# Altium schematic sheet PolXMain.SchDoc
size A0; SheetNumber: 0; SheetTotal: 0; PageSetup: Record=PageOptions|CenterHorizontal=True|CenterVertical=True|PrintScale=0.50|XCorrection=1.00|YCorrection=1.00|PrintKind=2|BorderSize=5000000|LeftOffset=0|BottomOffset=0|Orientation=2|PaperLength=1000|PaperWidth=1000|Scale=100|PaperSource=7|PrintQuality=-4|MediaType=1|DitherType=10|PaperKind=A4|PrintScaleMode=1
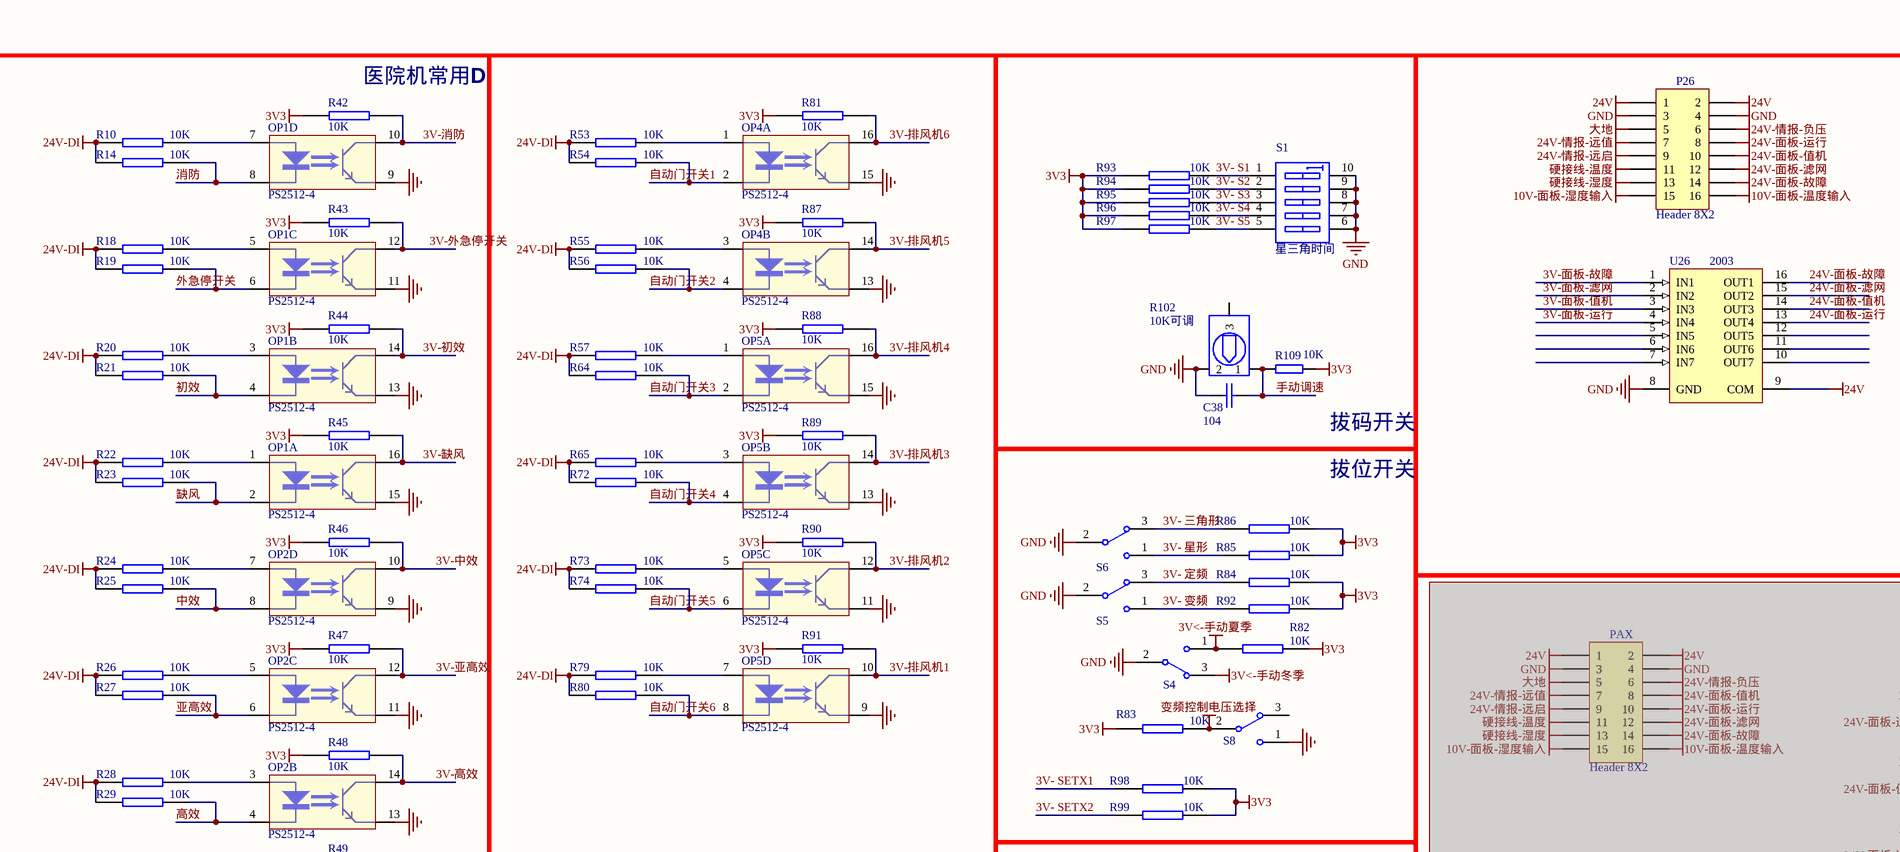
[diagram p0: PolXMain.SchDoc, top left]
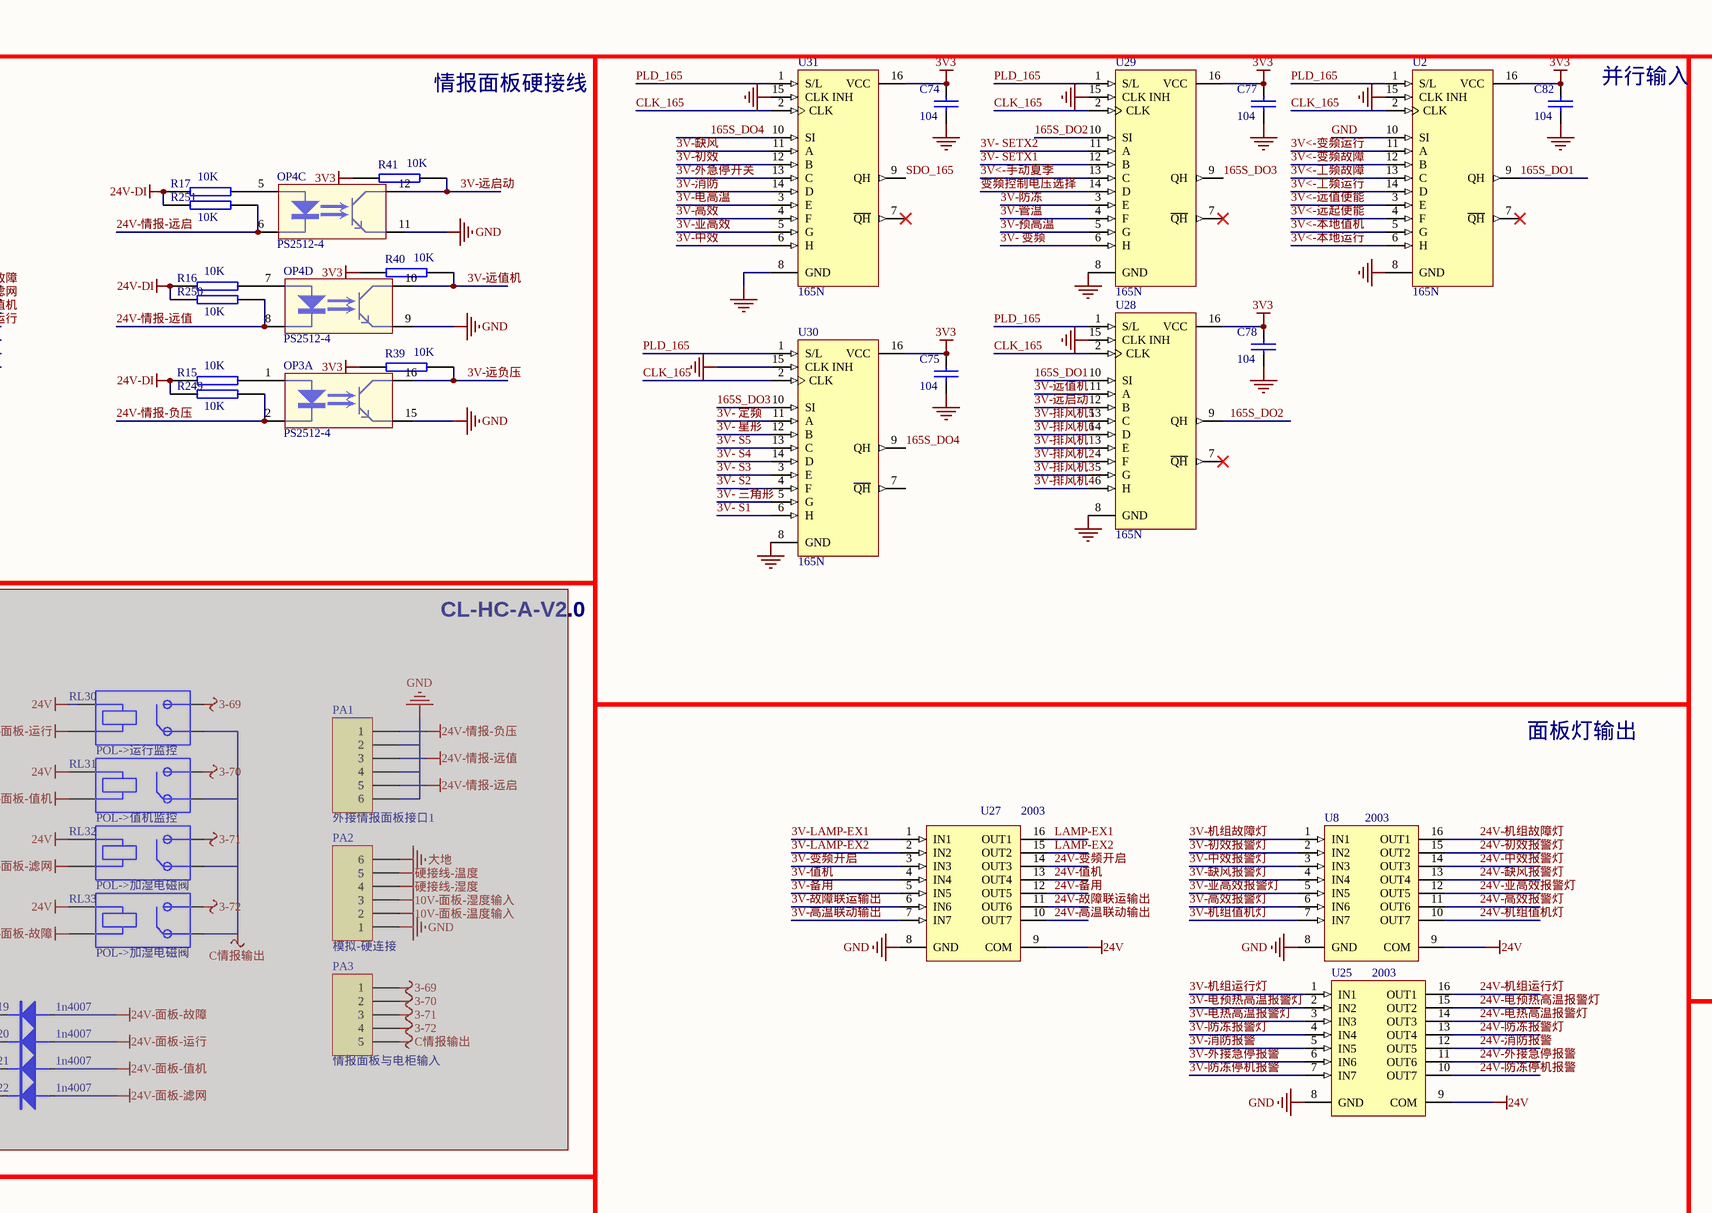
[diagram p1: PolXMain.SchDoc, top middle]
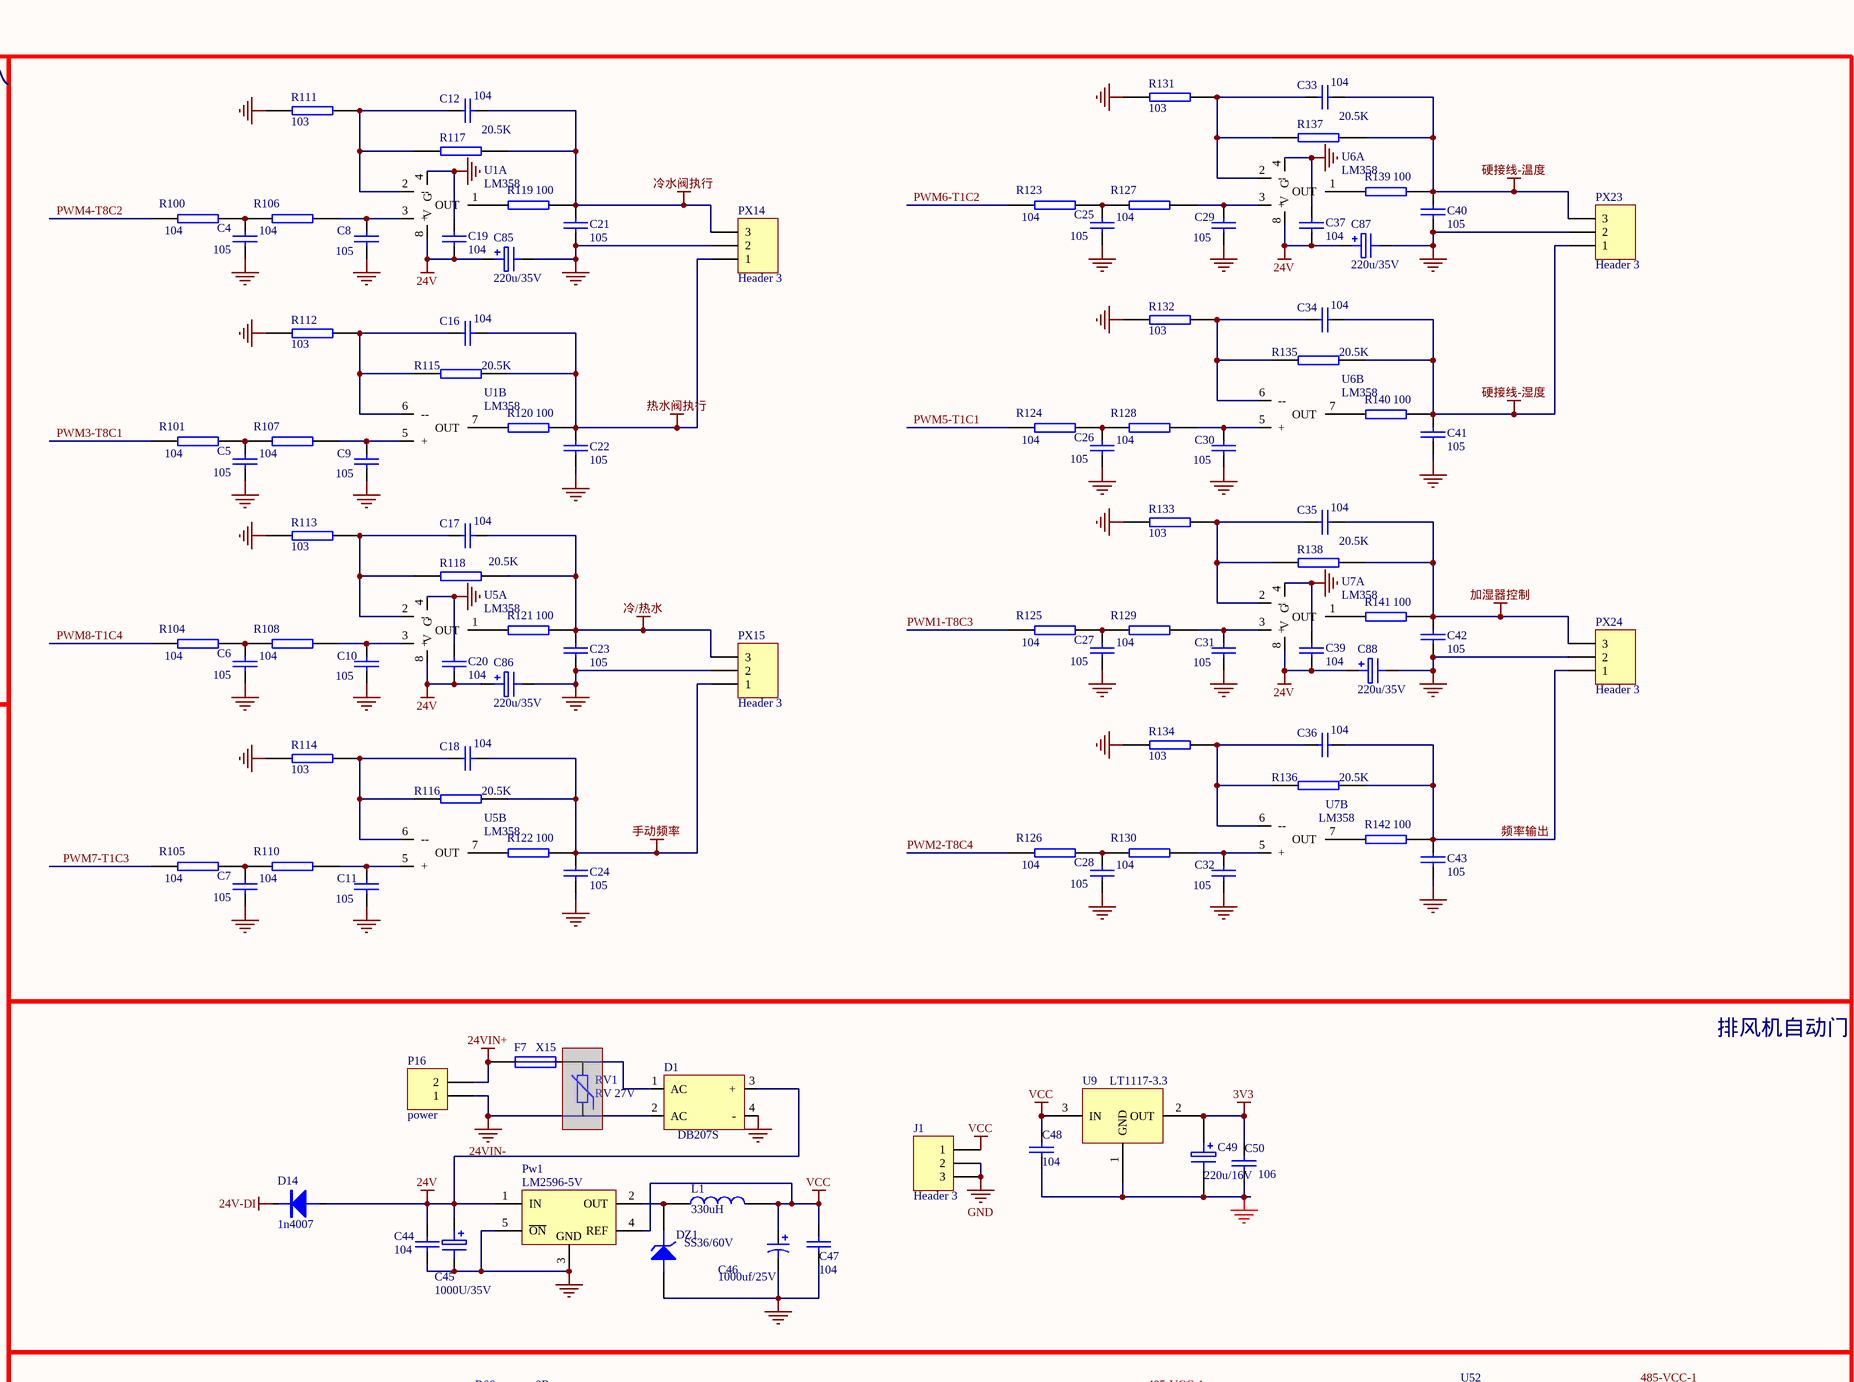
[diagram p2: PolXMain.SchDoc, top right]
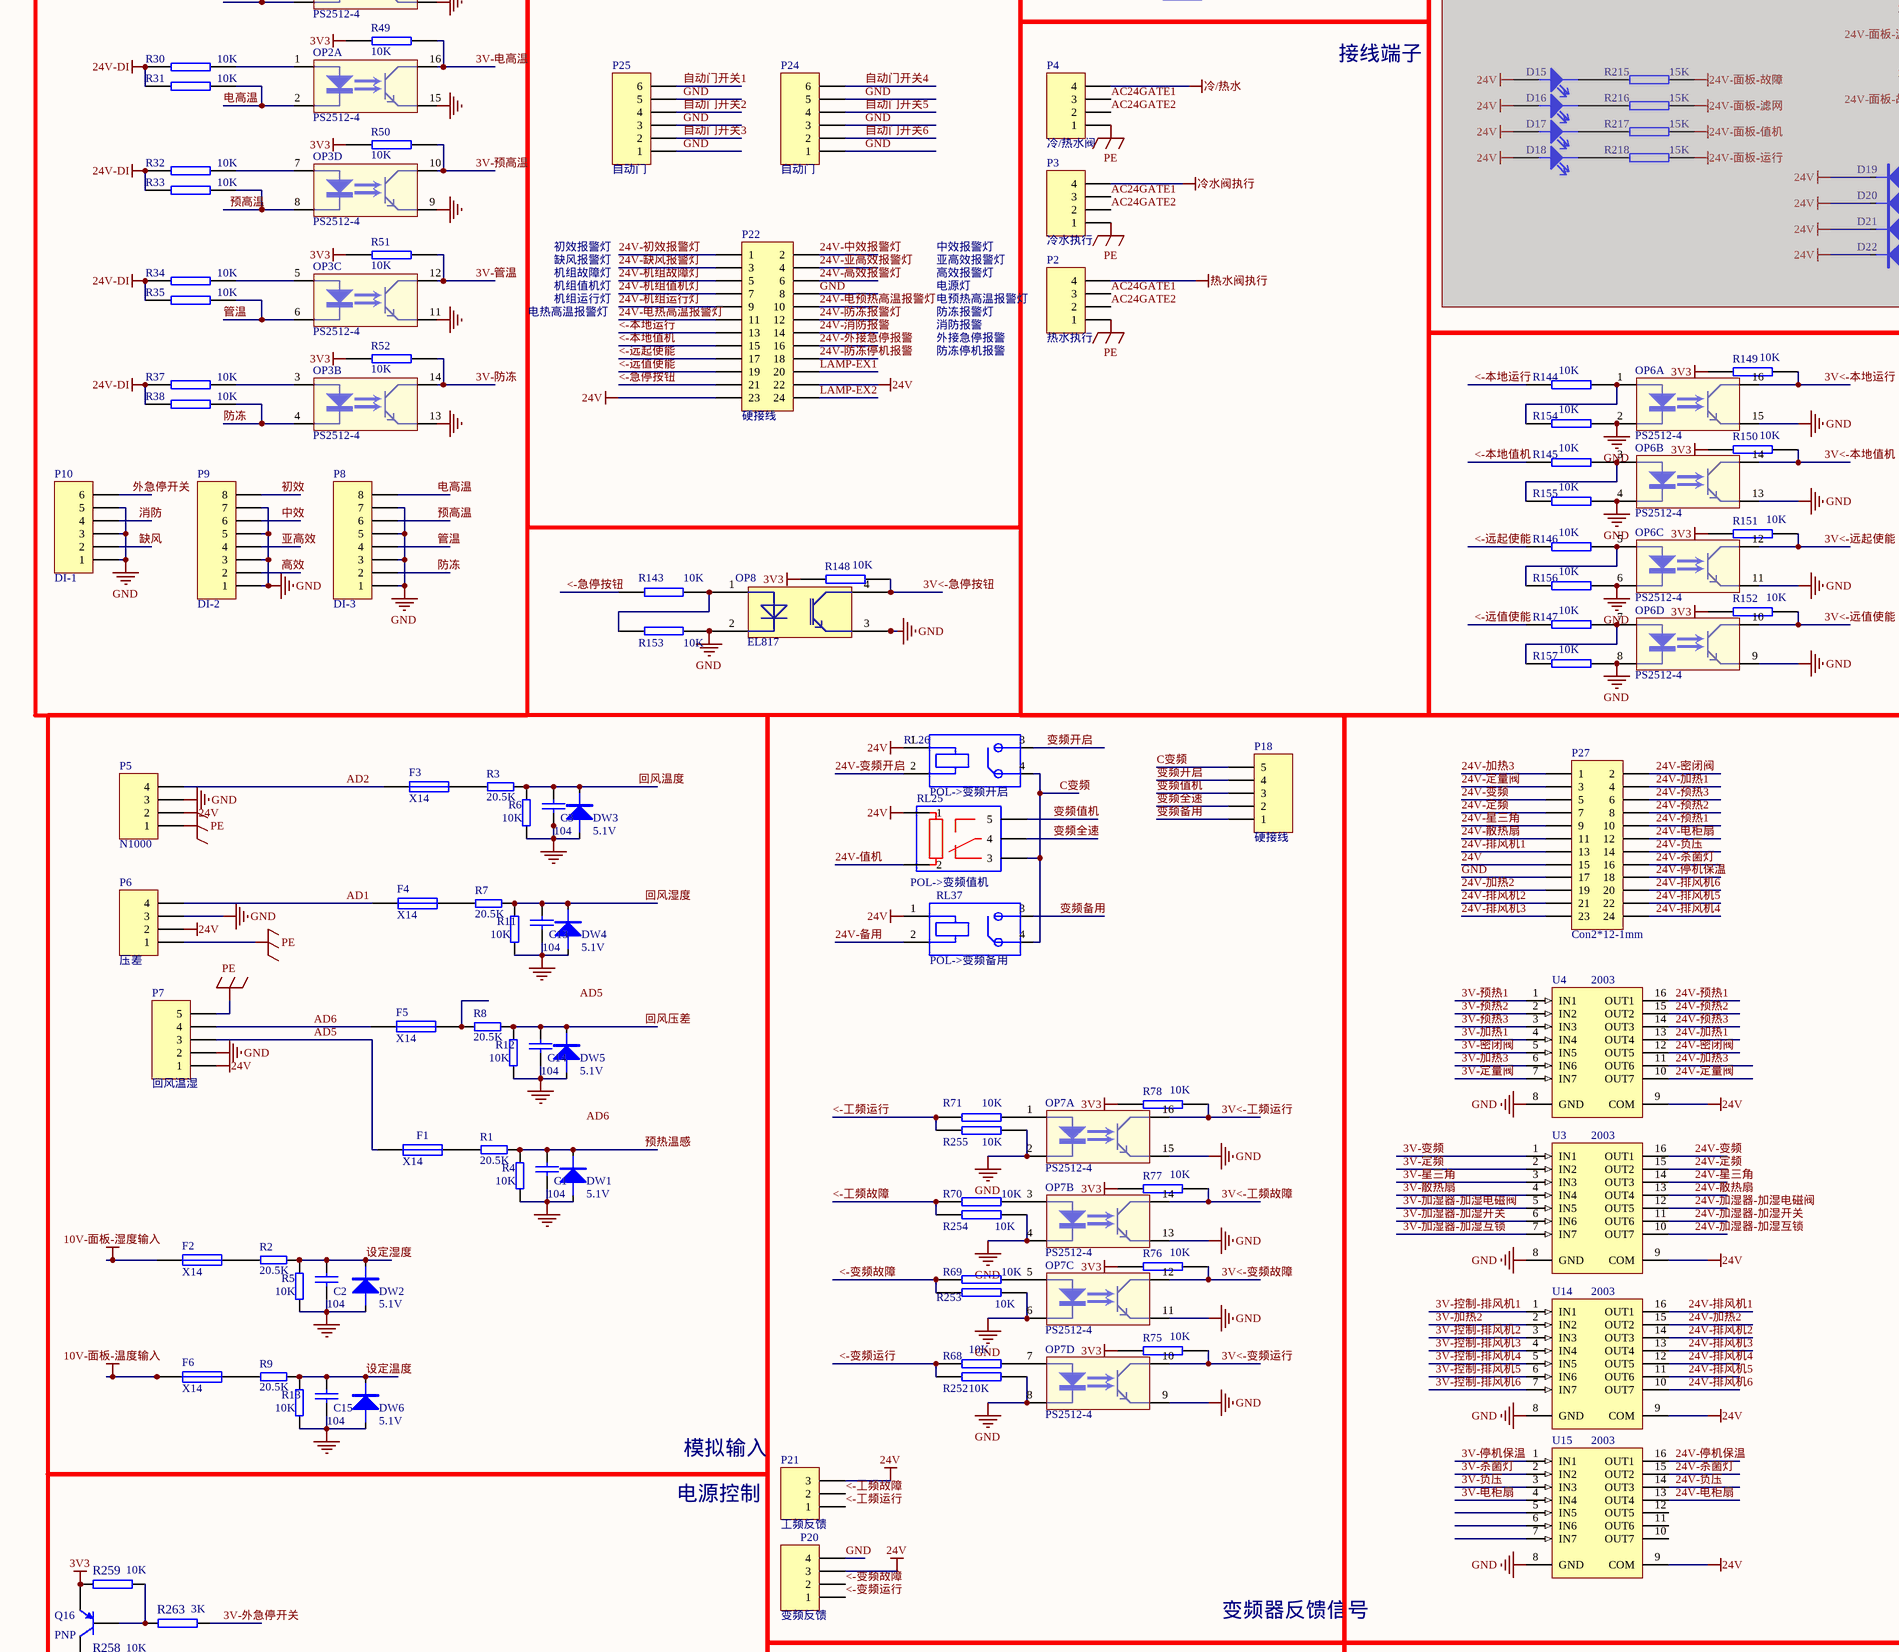
[diagram p3: PolXMain.SchDoc, centre left]
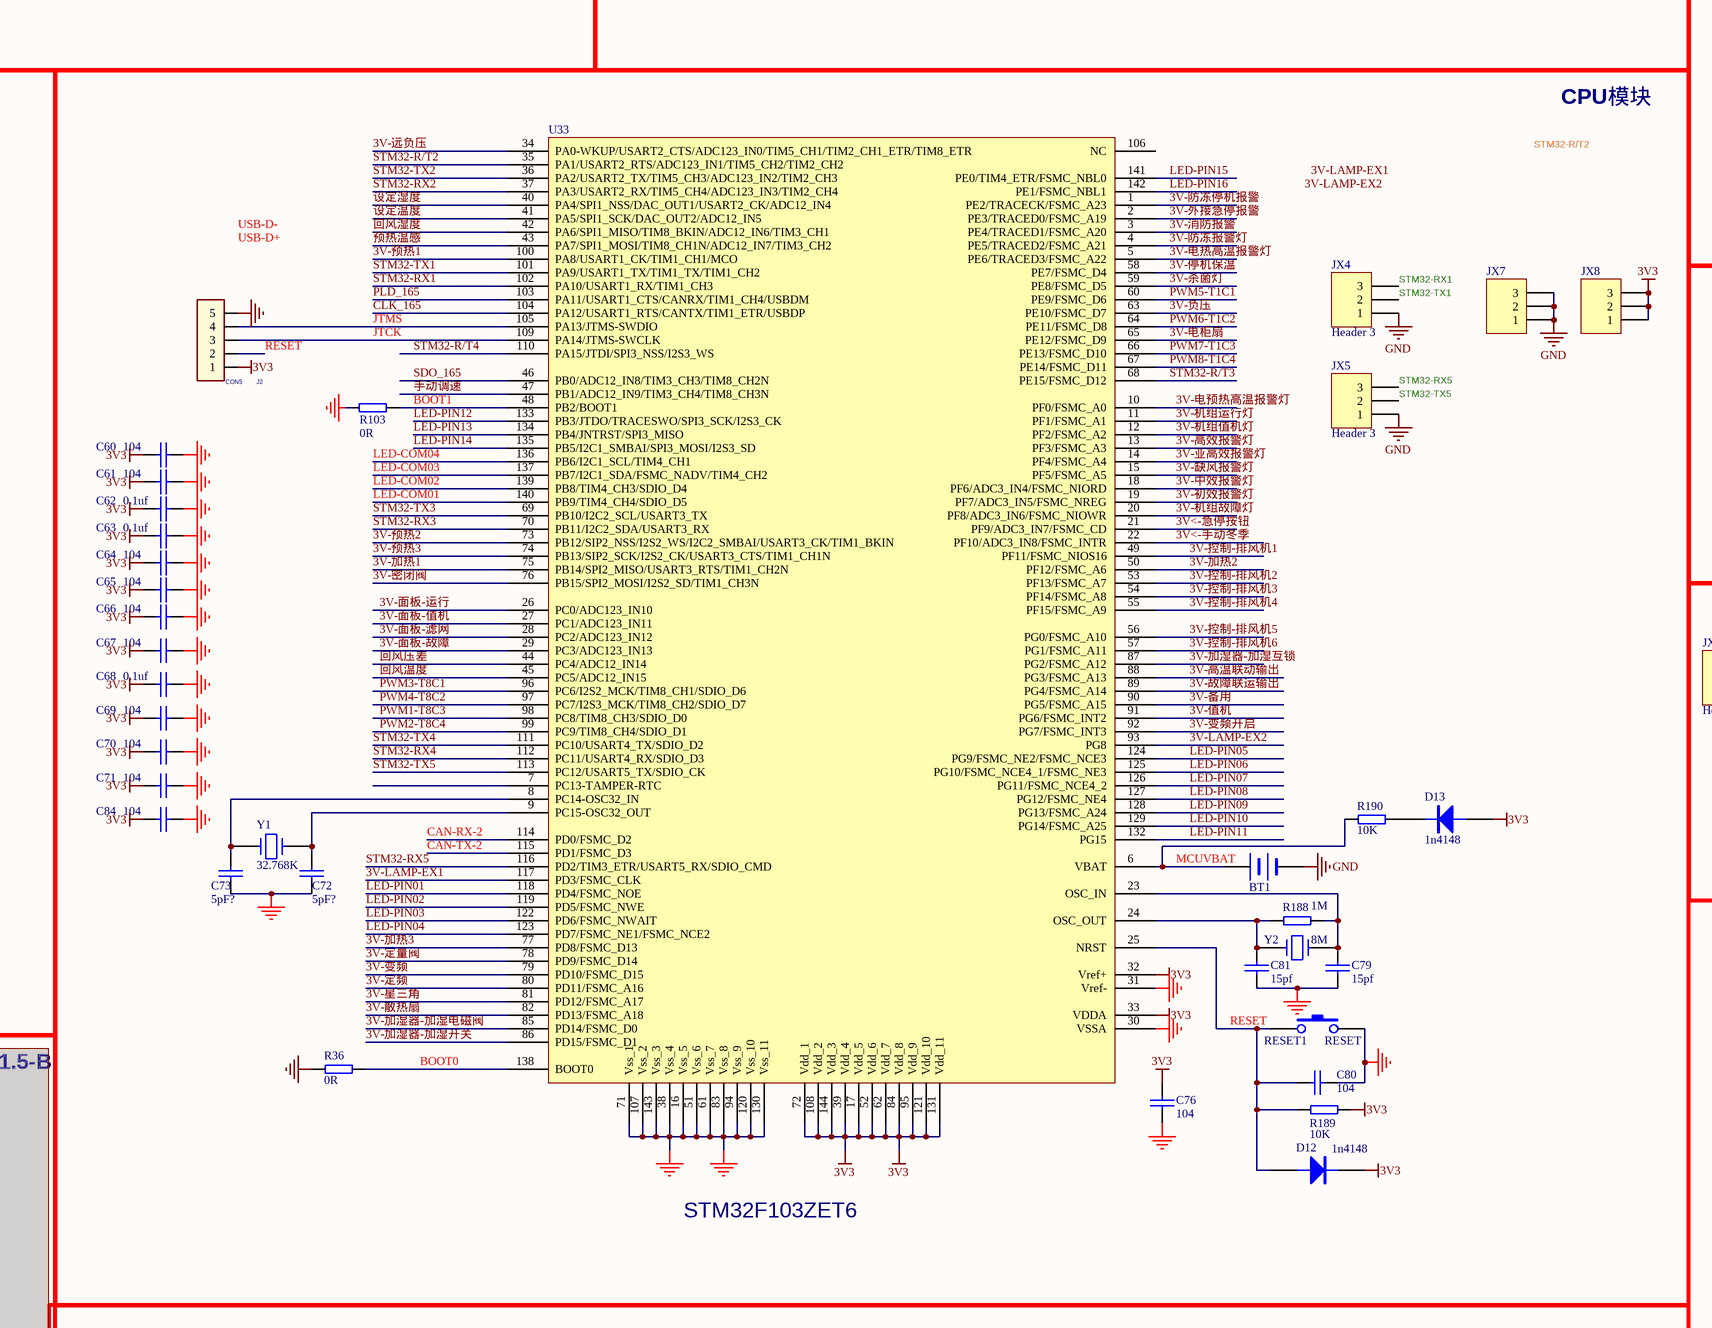
[diagram p4: PolXMain.SchDoc, centre middle]
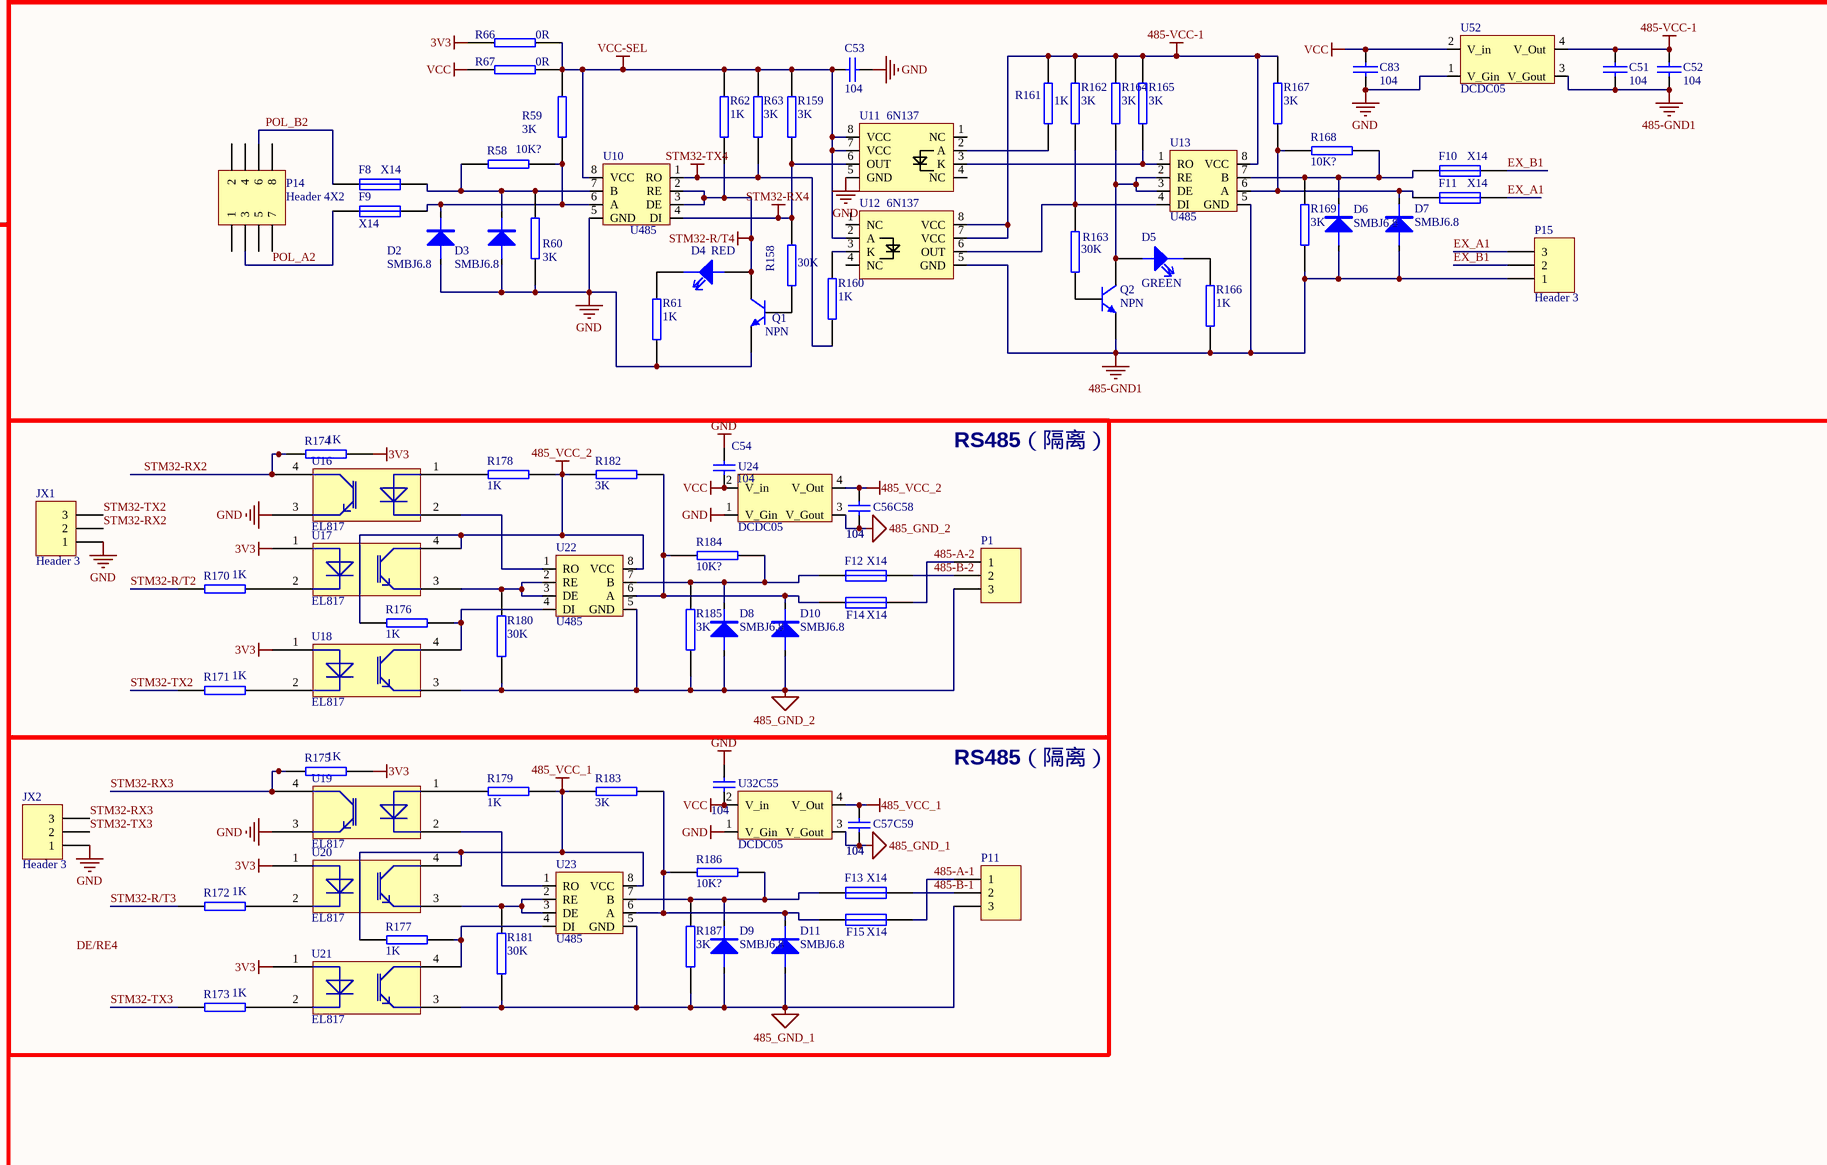
[diagram p5: PolXMain.SchDoc, centre right]
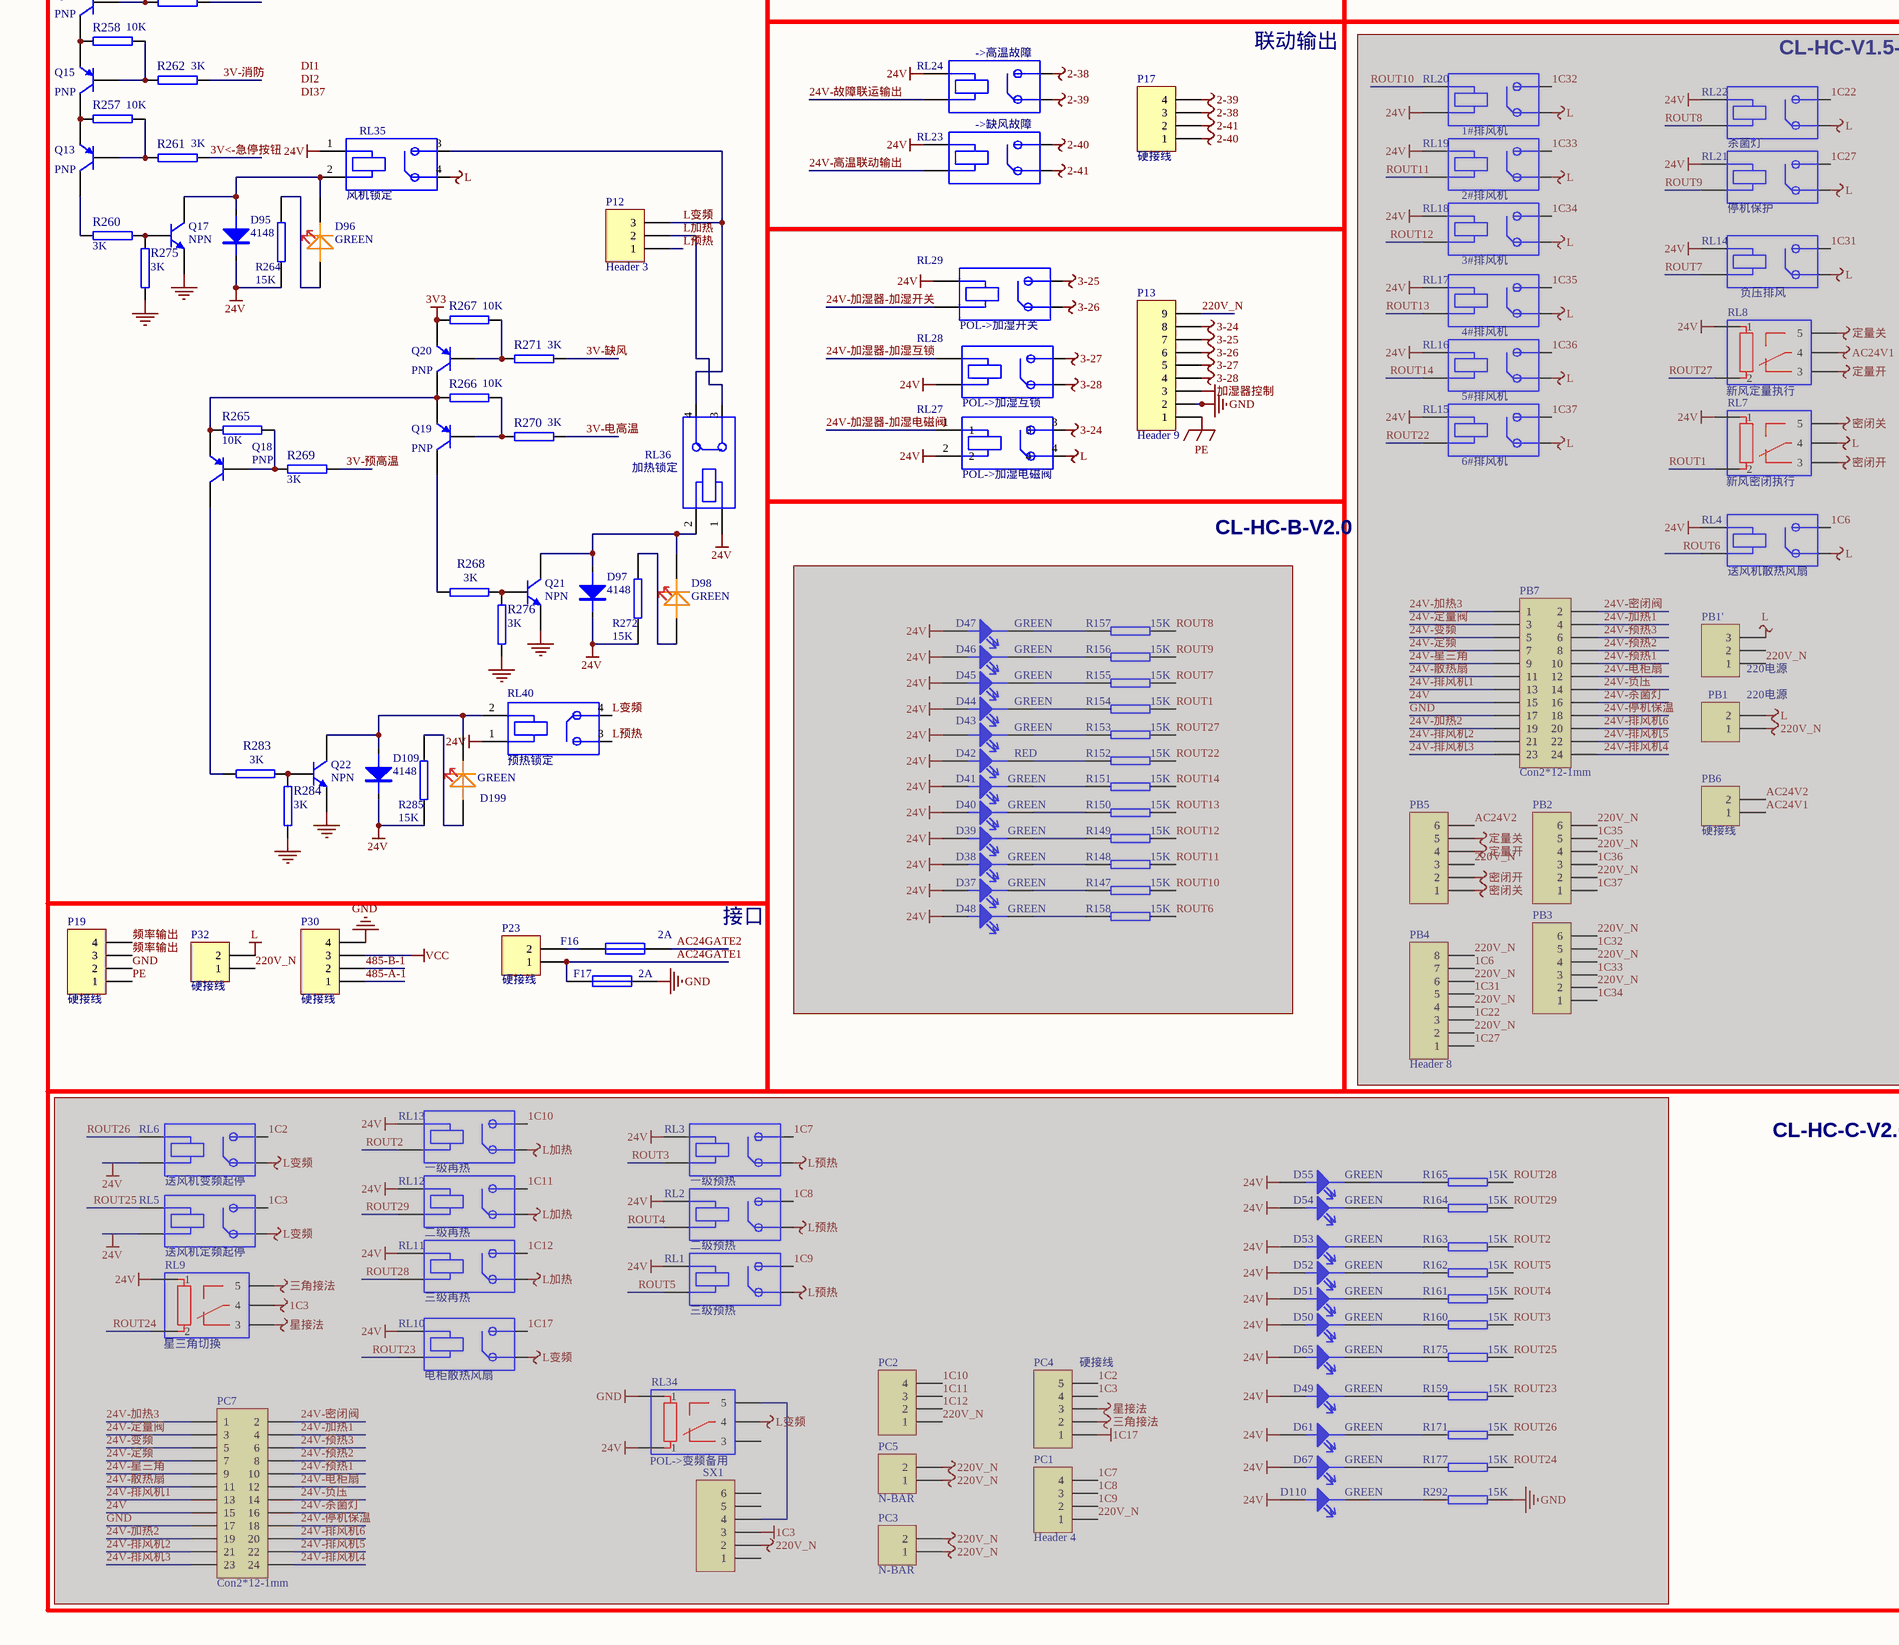
[diagram p6: PolXMain.SchDoc, bottom left]
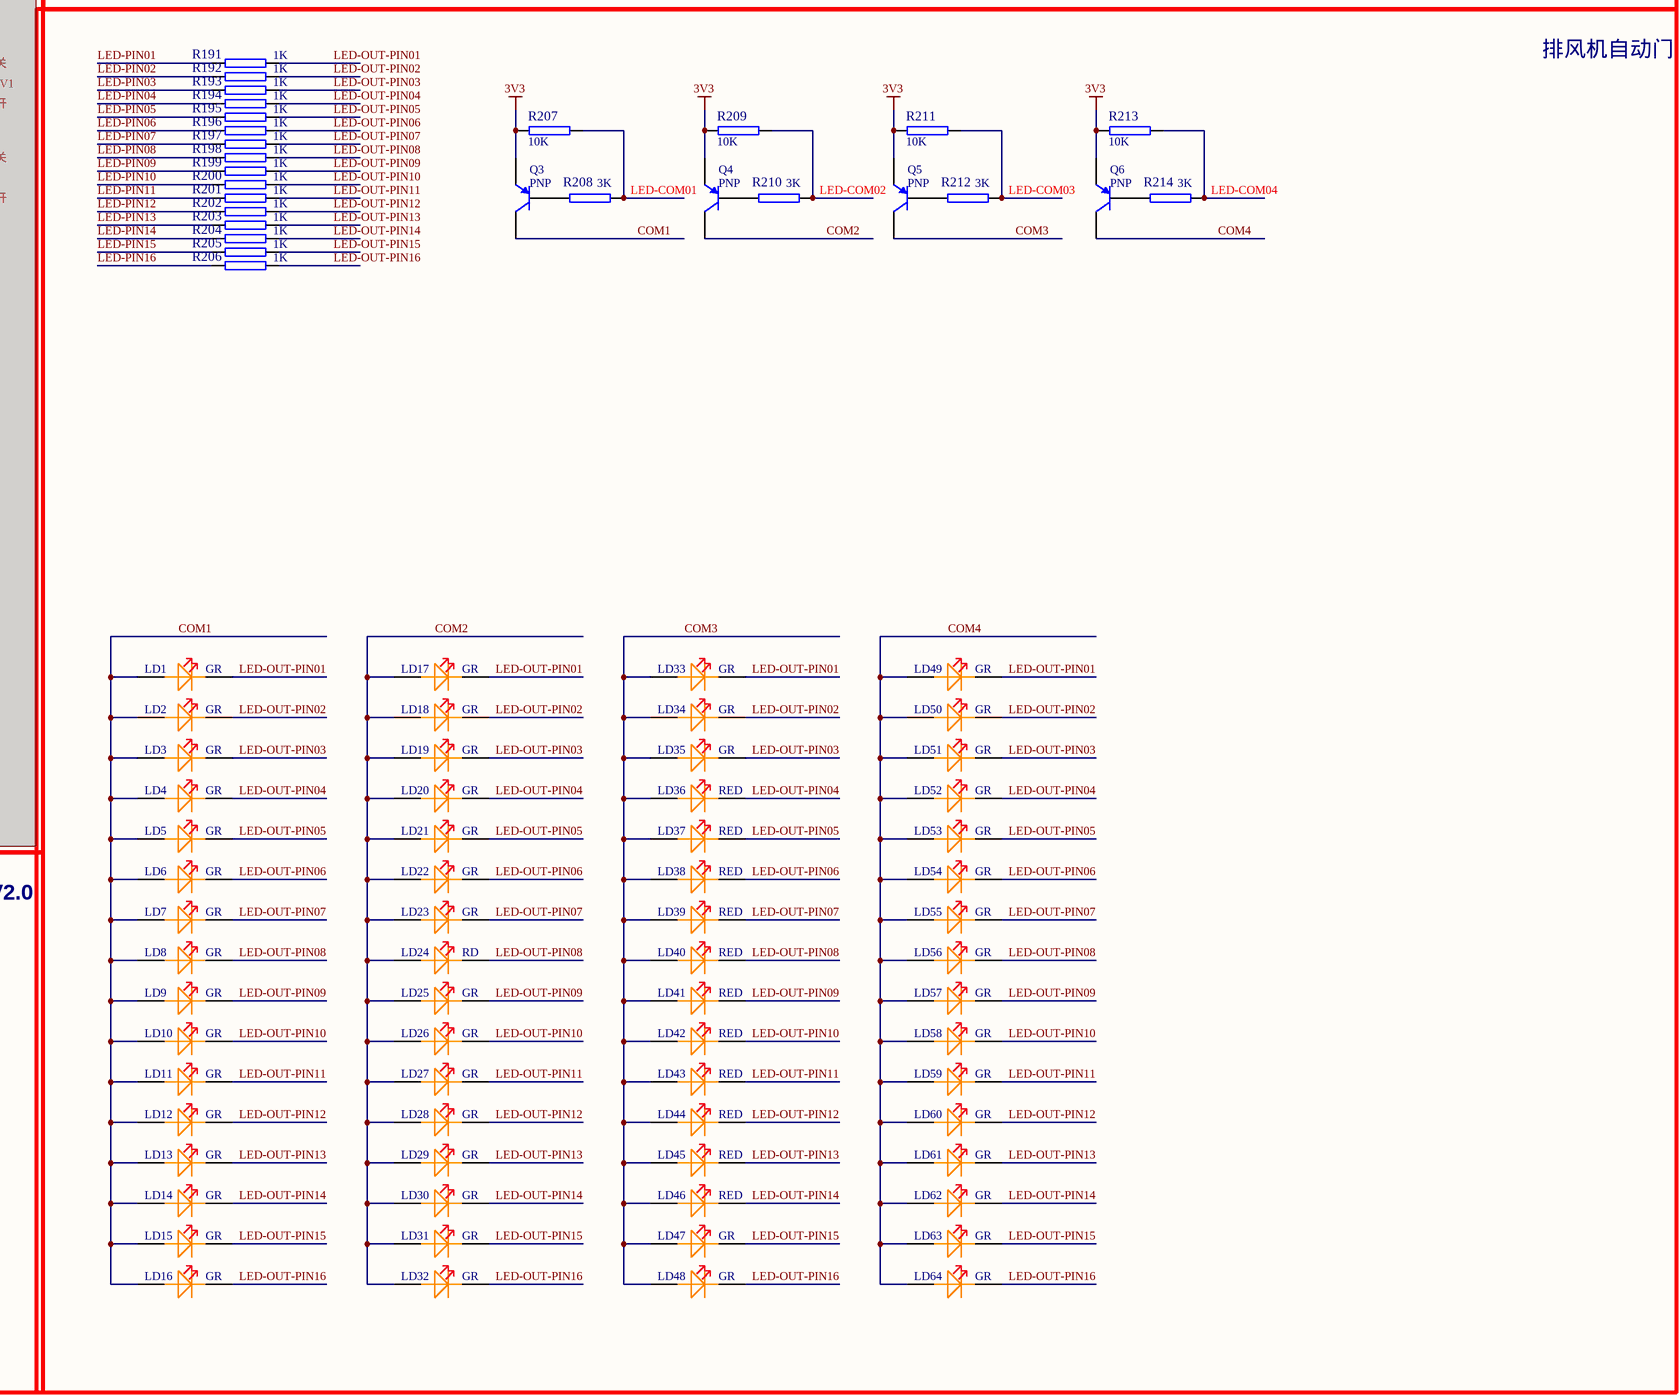
[diagram p7: PolXMain.SchDoc, bottom middle]

## Parts
(Parts that share a designator on the sheet are numbered #1, #2 ... from top to bottom, then left to right.)
BT1  BATTERY  [BAT]  (value not drawn)
C1  104  [C0805]
C2  104  [C0805]
C3  104  [C0805]
C4  105  [C0805C]
C5  105  [C0805C]
C6  105  [C0805C]
C7  105  [C0805C]
C8  105  [C0805C]
C9  105  [C0805C]
C10  105  [C0805C]
C11  105  [C0805C]
C12  104  [C0805]
C13  104  [C0805]
C14  104  [C0805]
C15  104  [C0805]
C16  104  [C0805]
C17  104  [C0805]
C18  104  [C0805]
C19  104  [C0805]
C20  104  [C0805]
C21  105  [C0805C]
C22  105  [C0805C]
C23  105  [C0805C]
C24  105  [C0805C]
C25  105  [C0805C]
C26  105  [C0805C]
C27  105  [C0805C]
C28  105  [C0805C]
C29  105  [C0805C]
C30  105  [C0805C]
C31  105  [C0805C]
C32  105  [C0805C]
C33  104  [C0805]
C34  104  [C0805]
C35  104  [C0805]
C36  104  [C0805]
C37  104  [C0805]
C38  104  [C0805]
C39  104  [C0805]
C40  105  [C0805C]
C41  105  [C0805C]
C42  105  [C0805C]
C43  105  [C0805C]
C44  104  [C0805]
C45  1000U/35V  [E10MM-13]
C46  1000uf/25V  [E10MM-13]
C47  104  [C0805]
C48  104  [c0805]
C49  220u/16V  [E8MM]
C50  106  [c0805]
C51  104  [c0805]
C52  104  [c0805]
C53  104  [c0805]
C54  104  [C0805]
C55  104  [C0805]
C56  104  [C0805]
C57  104  [C0805]
C58  104  [C0805]
C59  104  [C0805]
C60  104  [C0805]
C61  104  [C0805]
C62  0.1uf  [C0805]
C63  0.1uf  [C0805]
C64  104  [C0805]
C65  104  [C0805]
C66  104  [C0805]
C67  104  [C0805]
C68  0.1uf  [C0805]
C69  104  [C0805]
C70  104  [C0805]
C71  104  [C0805]
C72  5pF?  [c0805]
C73  5pF?  [c0805]
C74  104  [C0805]
C75  104  [C0805]
C76  104  [c0805]
C77  104  [C0805]
C78  104  [C0805]
C79  15pf  [c0805]
C80  104  [c0805]
C81  15pf  [c0805]
C82  104  [C0805]
C83  104  [c0805]
C84  104  [C0805]
C85  220u/35V  [E8MM]
C86  220u/35V  [E8MM]
C87  220u/35V  [E8MM]
C88  220u/35V  [E8MM]
D1  DB207S  [Brg]
D2  SMBJ6.8  [SMBJ_SMT]
D3  SMBJ6.8  [SMBJ_SMT]
D4  RED  [0805_B]
D5  GREEN  [0805_B]
D6  SMBJ6.8  [SMBJ_SMT]
D7  SMBJ6.8  [SMBJ_SMT]
D8  SMBJ6.8  [SMBJ_SMT]
D9  SMBJ6.8  [SMBJ_SMT]
D10  SMBJ6.8  [SMBJ_SMT]
D11  SMBJ6.8  [SMBJ_SMT]
D12  1n4148  [1206AK1]
D13  1n4148  [1206AK1]
D14  1n4007  [1206AK]
D15  (no value)  [RT_LED1]  (masked out: inside a compile mask, not in the netlist)
D16  (no value)  [RT_LED1]  (masked out: inside a compile mask, not in the netlist)
D17  (no value)  [RT_LED1]  (masked out: inside a compile mask, not in the netlist)
D18  (no value)  [RT_LED1]  (masked out: inside a compile mask, not in the netlist)
D19  1n4007  [DIODEAK]  (masked out: inside a compile mask, not in the netlist)
D20  1n4007  [DIODEAK]  (masked out: inside a compile mask, not in the netlist)
D21  1n4007  [DIODEAK]  (masked out: inside a compile mask, not in the netlist)
D22  1n4007  [DIODEAK]  (masked out: inside a compile mask, not in the netlist)
D37  GREEN  [RT_LED1]  (masked out: inside a compile mask, not in the netlist)
D38  GREEN  [RT_LED1]  (masked out: inside a compile mask, not in the netlist)
D39  GREEN  [RT_LED1]  (masked out: inside a compile mask, not in the netlist)
D40  GREEN  [RT_LED1]  (masked out: inside a compile mask, not in the netlist)
D41  GREEN  [RT_LED1]  (masked out: inside a compile mask, not in the netlist)
D42  RED  [RT_LED1]  (masked out: inside a compile mask, not in the netlist)
D43  GREEN  [RT_LED1]  (masked out: inside a compile mask, not in the netlist)
D44  GREEN  [RT_LED1]  (masked out: inside a compile mask, not in the netlist)
D45  GREEN  [RT_LED1]  (masked out: inside a compile mask, not in the netlist)
D46  GREEN  [RT_LED1]  (masked out: inside a compile mask, not in the netlist)
D47  GREEN  [RT_LED1]  (masked out: inside a compile mask, not in the netlist)
D48  GREEN  [RT_LED1]  (masked out: inside a compile mask, not in the netlist)
D49  GREEN  [RT_LED1]  (masked out: inside a compile mask, not in the netlist)
D50  GREEN  [RT_LED1]  (masked out: inside a compile mask, not in the netlist)
D51  GREEN  [RT_LED1]  (masked out: inside a compile mask, not in the netlist)
D52  GREEN  [RT_LED1]  (masked out: inside a compile mask, not in the netlist)
D53  GREEN  [RT_LED1]  (masked out: inside a compile mask, not in the netlist)
D54  GREEN  [RT_LED1]  (masked out: inside a compile mask, not in the netlist)
D55  GREEN  [RT_LED1]  (masked out: inside a compile mask, not in the netlist)
D61  GREEN  [RT_LED1]  (masked out: inside a compile mask, not in the netlist)
D65  GREEN  [RT_LED1]  (masked out: inside a compile mask, not in the netlist)
D67  GREEN  [RT_LED1]  (masked out: inside a compile mask, not in the netlist)
D95  4148  [1206AK]
D96  GREEN  [0805_B]
D97  4148  [1206AK]
D98  GREEN  [0805_B]
D109  4148  [1206AK]
D110  GREEN  [RT_LED1]  (masked out: inside a compile mask, not in the netlist)
D199  GREEN  [0805_B]
DW1  5.1V  [1206AK]
DW2  5.1V  [1206AK]
DW3  5.1V  [1206AK]
DW4  5.1V  [1206AK]
DW5  5.1V  [1206AK]
DW6  5.1V  [1206AK]
DZ1  SS36/60V  [SMBJ_SMT]
F1  X14  [PPTC_SMT]
F2  X14  [PPTC_SMT]
F3  X14  [PPTC_SMT]
F4  X14  [PPTC_SMT]
F5  X14  [PPTC_SMT]
F6  X14  [PPTC_SMT]
F7  X15  [PPTC_SMT]
F8  X14  [PPTC_SMT]
F9  X14  [PPTC_SMT]
F10  X14  [PPTC_SMT]
F11  X14  [PPTC_SMT]
F12  X14  [PPTC_SMT]
F13  X14  [PPTC_SMT]
F14  X14  [PPTC_SMT]
F15  X14  [PPTC_SMT]
F16  2A  [PPTC_SMT]
F17  2A  [PPTC_SMT]
J1  Header 3  [DC-005A]
J2  CON5  [CZ5-2.54]
JX1  Header 3  [HDR1X3]
JX2  Header 3  [HDR1X3]
JX4  Header 3  [HDR1X3]
JX5  Header 3  [HDR1X3]
JX7  (no value)  [HDR1X3]
JX8  (no value)  [HDR1X3]
L1  330uH  [L8MM]
LD1  GR  [0805_B]
LD2  GR  [0805_B]
LD3  GR  [0805_B]
LD4  GR  [0805_B]
LD5  GR  [0805_B]
LD6  GR  [0805_B]
LD7  GR  [0805_B]
LD8  GR  [0805_B]
LD9  GR  [0805_B]
LD10  GR  [0805_B]
LD11  GR  [0805_B]
LD12  GR  [0805_B]
LD13  GR  [0805_B]
LD14  GR  [0805_B]
LD15  GR  [0805_B]
LD16  GR  [0805_B]
LD17  GR  [0805_B]
LD18  GR  [0805_B]
LD19  GR  [0805_B]
LD20  GR  [0805_B]
LD21  GR  [0805_B]
LD22  GR  [0805_B]
LD23  GR  [0805_B]
LD24  RD  [0805_B]
LD25  GR  [0805_B]
LD26  GR  [0805_B]
LD27  GR  [0805_B]
LD28  GR  [0805_B]
LD29  GR  [0805_B]
LD30  GR  [0805_B]
LD31  GR  [0805_B]
LD32  GR  [0805_B]
LD33  GR  [0805_B]
LD34  GR  [0805_B]
LD35  GR  [0805_B]
LD36  RED  [0805_B]
LD37  RED  [0805_B]
LD38  RED  [0805_B]
LD39  RED  [0805_B]
LD40  RED  [0805_B]
LD41  RED  [0805_B]
LD42  RED  [0805_B]
LD43  RED  [0805_B]
LD44  RED  [0805_B]
LD45  RED  [0805_B]
LD46  RED  [0805_B]
LD47  GR  [0805_B]
LD48  GR  [0805_B]
LD49  GR  [0805_B]
LD50  GR  [0805_B]
LD51  GR  [0805_B]
LD52  GR  [0805_B]
LD53  GR  [0805_B]
LD54  GR  [0805_B]
LD55  GR  [0805_B]
LD56  GR  [0805_B]
LD57  GR  [0805_B]
LD58  GR  [0805_B]
LD59  GR  [0805_B]
LD60  GR  [0805_B]
LD61  GR  [0805_B]
LD62  GR  [0805_B]
LD63  GR  [0805_B]
LD64  GR  [0805_B]
OP1  PS2512-4  [SO_16L]  (parts A,B,C,D of 4)
OP2  PS2512-4  [SO_16L]  (parts A,B,C,D of 4)
OP3  PS2512-4  [SO_16L]  (parts A,B,C,D of 4)
OP4  PS2512-4  [SO_16L]  (parts A,B,C,D of 4)
OP5  PS2512-4  [SO_16L]  (parts A,B,C,D of 4)
OP6  PS2512-4  [SO_16L]  (parts A,B,C,D of 4)
OP7  PS2512-4  [SO_16L]  (parts A,B,C,D of 4)
OP8  EL817  [EL-817]
P1  (no value)  [PL3X]
P2  热水执行  [PL4X]
P3  冷水执行  [PL4X]
P4  冷/热水阀  [PL4X]
P5  N1000  [PL4X]
P6  压差  [PL4X]
P7  回风温湿  [PL5X]
P8  DI-3  [PL8X]
P9  DI-2  [PL8X]
P10  DI-1  [PL6X]
P11  (no value)  [PL3X]
P12  Header 3  [PL3X]
P13  Header 9  [PL9X]
P14  Header 4X2  [RH45]
P15  Header 3  [PL3X]
P16  power  [PL2X]
P17  硬接线  [PL4X]
P18  硬接线  [PL5X]
P19  硬接线  [PL4X]
P20  变频反馈  [PL4X]
P21  工频反馈  [PL3X]
P22  硬接线  [ATX_24PIN]
P23  硬接线  [PL2X]
P24  自动门  [PL6X]
P25  自动门  [PL6X]
P26  Header 8X2  [Con2*8-1mm]
P27  Con2*12-1mm  [FC24LX]
P30  硬接线  [C3-4]
P32  硬接线  [PL2X]
PA1  外接情报面板接口1  [PL6X]  (masked out: inside a compile mask, not in the netlist)
PA2  模拟-硬连接  [PL6X]  (masked out: inside a compile mask, not in the netlist)
PA3  情报面板与电柜输入  [pl5x]  (masked out: inside a compile mask, not in the netlist)
PAX  Header 8X2  [centipede-16]  (masked out: inside a compile mask, not in the netlist)
PB1  220电源  [95-2P]  (masked out: inside a compile mask, not in the netlist)
PB1'  220电源  [PL3X]  (masked out: inside a compile mask, not in the netlist)
PB2  Header 6  [PL6X]  (value not drawn)  (masked out: inside a compile mask, not in the netlist)
PB3  Header 6  [PL6X]  (value not drawn)  (masked out: inside a compile mask, not in the netlist)
PB4  Header 8  [PL8X]  (masked out: inside a compile mask, not in the netlist)
PB5  硬接线  [PL6X]  (value not drawn)  (masked out: inside a compile mask, not in the netlist)
PB6  硬接线  [PL2X]  (masked out: inside a compile mask, not in the netlist)
PB7  Con2*12-1mm  [FC24LX]  (masked out: inside a compile mask, not in the netlist)
PC1  Header 4  [PL4X]  (masked out: inside a compile mask, not in the netlist)
PC2  Header 4  [PL4X]  (value not drawn)  (masked out: inside a compile mask, not in the netlist)
PC3  N-BAR  [PL2X]  (masked out: inside a compile mask, not in the netlist)
PC4  硬接线  [PL5X]  (masked out: inside a compile mask, not in the netlist)
PC5  N-BAR  [PL2X]  (masked out: inside a compile mask, not in the netlist)
PC7  Con2*12-1mm  [FC24LX]  (masked out: inside a compile mask, not in the netlist)
Pw1  LM2596-5V  [LM2575]
PX14  Header 3  [HDR1X3]
PX15  Header 3  [HDR1X3]
PX23  Header 3  [HDR1X3]
PX24  Header 3  [HDR1X3]
Q1  NPN  [SOT23]
Q2  NPN  [SOT23]
Q3  PNP  [SOT23]
Q4  PNP  [SOT23]
Q5  PNP  [SOT23]
Q6  PNP  [SOT23]
Q13  PNP  [SOT23]
Q15  PNP  [SOT23]
Q16  PNP  [SOT23]
Q17  NPN  [SOT23]
Q18  PNP  [SOT23]
Q19  PNP  [SOT23]
Q20  PNP  [SOT23]
Q21  NPN  [SOT23]
Q22  NPN  [SOT23]
R1  20.5K  [0805R]
R2  20.5K  [0805R]
R3  20.5K  [0805R]
R4  10K  [0805R]
R5  10K  [0805R]
R6  10K  [0805R]
R7  20.5K  [0805R]
R8  20.5K  [0805R]
R9  20.5K  [0805R]
R10  10K  [0805R]
R11  10K  [0805R]
R12  10K  [0805R]
R13  10K  [0805R]
R14  10K  [0805R]
R15  10K  [0805R]
R16  10K  [0805R]
R17  10K  [0805R]
R18  10K  [0805R]
R19  10K  [0805R]
R20  10K  [0805R]
R21  10K  [0805R]
R22  10K  [0805R]
R23  10K  [0805R]
R24  10K  [0805R]
R25  10K  [0805R]
R26  10K  [0805R]
R27  10K  [0805R]
R28  10K  [0805R]
R29  10K  [0805R]
R30  10K  [0805R]
R31  10K  [0805R]
R32  10K  [0805R]
R33  10K  [0805R]
R34  10K  [0805R]
R35  10K  [0805R]
R36  0R  [0805R]
R37  10K  [0805R]
R38  10K  [0805R]
R39  10K  [0805R]
R40  10K  [0805R]
R41  10K  [0805R]
R42  10K  [0805R]
R43  10K  [0805R]
R44  10K  [0805R]
R45  10K  [0805R]
R46  10K  [0805R]
R47  10K  [0805R]
R48  10K  [0805R]
R49  10K  [0805R]
R50  10K  [0805R]
R51  10K  [0805R]
R52  10K  [0805R]
R53  10K  [0805R]
R54  10K  [0805R]
R55  10K  [0805R]
R56  10K  [0805R]
R57  10K  [0805R]
R58  10K?  [0805R]
R59  3K  [0805R]
R60  3K  [0805R]
R61  1K  [0805R]
R62  1K  [0805R]
R63  3K  [0805R]
R64  10K  [0805R]
R65  10K  [0805R]
R66  0R  [0805R]
R67  0R  [0805R]
R68  10K  [0805R]
R69  10K  [0805R]
R70  10K  [0805R]
R71  10K  [0805R]
R72  10K  [0805R]
R73  10K  [0805R]
R74  10K  [0805R]
R75  10K  [0805R]
R76  10K  [0805R]
R77  10K  [0805R]
R78  10K  [0805R]
R79  10K  [0805R]
R80  10K  [0805R]
R81  10K  [0805R]
R82  10K  [0805R]
R83  10K  [0805R]
R84  10K  [0805R]
R85  10K  [0805R]
R86  10K  [0805R]
R87  10K  [0805R]
R88  10K  [0805R]
R89  10K  [0805R]
R90  10K  [0805R]
R91  10K  [0805R]
R92  10K  [0805R]
R93  10K  [0805R]
R94  10K  [0805R]
R95  10K  [0805R]
R96  10K  [0805R]
R97  10K  [0805R]
R98  10K  [0805R]
R99  10K  [0805R]
R100  104  [0805R]
R101  104  [0805R]
R102  10K可调  [RES_adj]
R103  0R  [0805R]
R104  104  [0805R]
R105  104  [0805R]
R106  104  [0805R]
R107  104  [0805R]
R108  104  [0805R]
R109  10K  [0805R]
R110  104  [0805R]
R111  103  [0805R]
R112  103  [0805R]
R113  103  [0805R]
R114  103  [0805R]
R115  20.5K  [0805R]
R116  20.5K  [0805R]
R117  20.5K  [0805R]
R118  20.5K  [0805R]
R119  100  [0805R]
R120  100  [0805R]
R121  100  [0805R]
R122  100  [0805R]
R123  104  [0805R]
R124  104  [0805R]
R125  104  [0805R]
R126  104  [0805R]
R127  104  [0805R]
R128  104  [0805R]
R129  104  [0805R]
R130  104  [0805R]
R131  103  [0805R]
R132  103  [0805R]
R133  103  [0805R]
R134  103  [0805R]
R135  20.5K  [0805R]
R136  20.5K  [0805R]
R137  20.5K  [0805R]
R138  20.5K  [0805R]
R139  100  [0805R]
R140  100  [0805R]
R141  100  [0805R]
R142  100  [0805R]
R143  10K  [0805R]
R144  10K  [0805R]
R145  10K  [0805R]
R146  10K  [0805R]
R147#1  10K  [0805R]
R147#2  15K  [AXIAL0.4]  (masked out: inside a compile mask, not in the netlist)
R148#1  10K  [0805R]
R148#2  15K  [AXIAL0.4]  (masked out: inside a compile mask, not in the netlist)
R149#1  10K  [0805R]
R149#2  15K  [AXIAL0.4]  (masked out: inside a compile mask, not in the netlist)
R150#1  10K  [0805R]
R150#2  15K  [AXIAL0.4]  (masked out: inside a compile mask, not in the netlist)
R151#1  10K  [0805R]
R151#2  15K  [AXIAL0.4]  (masked out: inside a compile mask, not in the netlist)
R152#1  10K  [0805R]
R152#2  15K  [AXIAL0.4]  (masked out: inside a compile mask, not in the netlist)
R153#1  10K  [0805R]
R153#2  15K  [AXIAL0.4]  (masked out: inside a compile mask, not in the netlist)
R154#1  10K  [0805R]
R154#2  15K  [AXIAL0.4]  (masked out: inside a compile mask, not in the netlist)
R155#1  10K  [0805R]
R155#2  15K  [AXIAL0.4]  (masked out: inside a compile mask, not in the netlist)
R156#1  10K  [0805R]
R156#2  15K  [AXIAL0.4]  (masked out: inside a compile mask, not in the netlist)
R157#1  10K  [0805R]
R157#2  15K  [AXIAL0.4]  (masked out: inside a compile mask, not in the netlist)
R158#1  30K  [0805R]
R158#2  15K  [AXIAL0.4]  (masked out: inside a compile mask, not in the netlist)
R159#1  3K  [0805R]
R159#2  15K  [AXIAL0.4]  (masked out: inside a compile mask, not in the netlist)
R160#1  1K  [0805R]
R160#2  15K  [AXIAL0.4]  (masked out: inside a compile mask, not in the netlist)
R161#1  1K  [0805R]
R161#2  15K  [AXIAL0.4]  (masked out: inside a compile mask, not in the netlist)
R162#1  3K  [0805R]
R162#2  15K  [AXIAL0.4]  (masked out: inside a compile mask, not in the netlist)
R163#1  30K  [0805R]
R163#2  15K  [AXIAL0.4]  (masked out: inside a compile mask, not in the netlist)
R164#1  3K  [0805R]
R164#2  15K  [AXIAL0.4]  (masked out: inside a compile mask, not in the netlist)
R165#1  3K  [0805R]
R165#2  15K  [AXIAL0.4]  (masked out: inside a compile mask, not in the netlist)
R166  1K  [0805R]
R167  3K  [0805R]
R168  10K?  [0805R]
R169  3K  [0805R]
R170  1K  [0805R]
R171#1  1K  [0805R]
R171#2  15K  [AXIAL0.4]  (masked out: inside a compile mask, not in the netlist)
R172  1K  [0805R]
R173  1K  [0805R]
R174  1K  [0805R]
R175#1  1K  [0805R]
R175#2  15K  [AXIAL0.4]  (masked out: inside a compile mask, not in the netlist)
R176  1K  [0805R]
R177#1  1K  [0805R]
R177#2  15K  [AXIAL0.4]  (masked out: inside a compile mask, not in the netlist)
R178  1K  [0805R]
R179  1K  [0805R]
R180  30K  [0805R]
R181  30K  [0805R]
R182  3K  [0805R]
R183  3K  [0805R]
R184  10K?  [0805R]
R185  3K  [0805R]
R186  10K?  [0805R]
R187  3K  [0805R]
R188  1M  [0805R]
R189  10K  [0805R]
R190  10K  [0805R]
R191  1K  [0805R]
R192  1K  [0805R]
R193  1K  [0805R]
R194  1K  [0805R]
R195  1K  [0805R]
R196  1K  [0805R]
R197  1K  [0805R]
R198  1K  [0805R]
R199  1K  [0805R]
R200  1K  [0805R]
R201  1K  [0805R]
R202  1K  [0805R]
R203  1K  [0805R]
R204  1K  [0805R]
R205  1K  [0805R]
R206  1K  [0805R]
R207  10K  [0805R]
R208  3K  [0805R]
R209  10K  [0805R]
R210  3K  [0805R]
R211  10K  [0805R]
R212  3K  [0805R]
R213  10K  [0805R]
R214  3K  [0805R]
R215  15K  [AXIAL0.4]  (masked out: inside a compile mask, not in the netlist)
R216  15K  [AXIAL0.4]  (masked out: inside a compile mask, not in the netlist)
R217  15K  [AXIAL0.4]  (masked out: inside a compile mask, not in the netlist)
R218  15K  [AXIAL0.4]  (masked out: inside a compile mask, not in the netlist)
R249  10K  [0805R]
R250  10K  [0805R]
R251  10K  [0805R]
R252  10K  [0805R]
R253  10K  [0805R]
R254  10K  [0805R]
R255  10K  [0805R]
R257  10K  [0805R]
R258  10K  [0805R]
R259  10K  [0805R]
R260  3K  [0805R]
R261  3K  [0805R]
R262  3K  [0805R]
R263  3K  [0805R]
R264  15K  [0805R]
R265  10K  [0805R]
R266  10K  [0805R]
R267  10K  [0805R]
R268  3K  [0805R]
R269  3K  [0805R]
R270  3K  [0805R]
R271  3K  [0805R]
R272  15K  [0805R]
R275  3K  [0805R]
R276  3K  [0805R]
R283  3K  [0805R]
R284  3K  [0805R]
R285  15K  [0805R]
R292  15K  [AXIAL0.4]  (masked out: inside a compile mask, not in the netlist)
RESET1  RESET  [SIP2]
RL1  三级预热  [HF115-5]  (masked out: inside a compile mask, not in the netlist)
RL2  二级预热  [HF115-5]  (masked out: inside a compile mask, not in the netlist)
RL3  一级预热  [HF115-5]  (masked out: inside a compile mask, not in the netlist)
RL4  送风机散热风扇  [HF115-5]  (masked out: inside a compile mask, not in the netlist)
RL5  送风机定频起停  [HF115-5]  (masked out: inside a compile mask, not in the netlist)
RL6  送风机变频起停  [HF115-5]  (masked out: inside a compile mask, not in the netlist)
RL7  新风密闭执行  [HF115-5]  (masked out: inside a compile mask, not in the netlist)
RL8  新风定量执行  [HF115-5]  (masked out: inside a compile mask, not in the netlist)
RL9  星三角切换  [HF115-5]  (masked out: inside a compile mask, not in the netlist)
RL10  电柜散热风扇  [HF115-5]  (masked out: inside a compile mask, not in the netlist)
RL11  三级再热  [HF115-5]  (masked out: inside a compile mask, not in the netlist)
RL12  二级再热  [HF115-5]  (masked out: inside a compile mask, not in the netlist)
RL13  一级再热  [HF115-5]  (masked out: inside a compile mask, not in the netlist)
RL14  负压排风  [HF115-5]  (masked out: inside a compile mask, not in the netlist)
RL15  6#排风机  [HF115-5]  (masked out: inside a compile mask, not in the netlist)
RL16  5#排风机  [HF115-5]  (masked out: inside a compile mask, not in the netlist)
RL17  4#排风机  [HF115-5]  (masked out: inside a compile mask, not in the netlist)
RL18  3#排风机  [HF115-5]  (masked out: inside a compile mask, not in the netlist)
RL19  2#排风机  [HF115-5]  (masked out: inside a compile mask, not in the netlist)
RL20  1#排风机  [HF115-5]  (masked out: inside a compile mask, not in the netlist)
RL21  停机保护  [HF115-5]  (masked out: inside a compile mask, not in the netlist)
RL22  杀菌灯  [HF115-5]  (masked out: inside a compile mask, not in the netlist)
RL23  ->缺风故障  [RELAY12V]
RL24  ->高温故障  [RELAY12V]
RL25  POL->变频值机  [RELAY12V-5]
RL26  POL->变频开启  [RELAY12V]
RL27  POL->加湿电磁阀  [RELAY12V]
RL28  POL->加湿互锁  [RELAY12V]
RL29  POL->加湿开关  [RELAY12V]
RL30  POL->运行监控  [RELAY12V]  (masked out: inside a compile mask, not in the netlist)
RL31  POL->值机监控  [RELAY12V]  (masked out: inside a compile mask, not in the netlist)
RL32  POL->加湿电磁阀  [RELAY12V]  (masked out: inside a compile mask, not in the netlist)
RL33  POL->加湿电磁阀  [RELAY12V]  (masked out: inside a compile mask, not in the netlist)
RL34  POL->变频备用  [RELAY12V]  (masked out: inside a compile mask, not in the netlist)
RL35  风机锁定  [RELAY12V]
RL36  加热锁定  [RELAY12V]
RL37  POL->变频备用  [RELAY12V]
RL40  预热锁定  [RELAY12V]
RV1  RV 27V  [TNR1]  (masked out: inside a compile mask, not in the netlist)
S1  星三角时间  [DIP10]
S4  水温手动开关  [SEL3-MIN]  (value not drawn)
S5  定/变频  [SEL3-MIN]  (value not drawn)
S6  星三角选择  [SEL3-MIN]  (value not drawn)
S8  SW-SPDT  [SEL3-MIN]  (value not drawn)
SX1  红色 带盖 带灯 220V LA128-A  [SEL220V]  (value not drawn)  (masked out: inside a compile mask, not in the netlist)
U1  LM358  [SOP-08]  (parts A,B of 2)
U2  165N  [SO_16]
U3  2003  [SO_16]
U4  2003  [SO_16]
U5  LM358  [SOP-08]  (parts A,B of 2)
U6  LM358  [SOP-08]  (parts A,B of 2)
U7  LM358  [SOP-08]  (parts A,B of 2)
U8  2003  [SO_16]
U9  LT1117-3.3  [AMS1117]
U10  U485  [SOP8]
U11  6N137  [DIP8]
U12  6N137  [DIP8]
U13  U485  [SOP8]
U14  2003  [SO_16]
U15  2003  [SO_16]
U16  EL817  [EL-817]
U17  EL817  [EL-817]
U18  EL817  [EL-817]
U19  EL817  [EL-817]
U20  EL817  [EL-817]
U21  EL817  [EL-817]
U22  U485  [SOP8]
U23  U485  [SOP8]
U24  DCDC05  [VScore]
U25  2003  [SO_16]
U26  2003  [SO_16]
U27  2003  [SO_16]
U28  165N  [SO_16]
U29  165N  [SO_16]
U30  165N  [SO_16]
U31  165N  [SO_16]
U32  DCDC05  [VScore]
U33  STM32F103ZET6  [LQFP144]
U52  DCDC05  [VScore]
Y1  32.768K  [XTAL4]
Y2  8M  [XAL2]

## Blocks framed on the sheet
医院机常用DI: OP1-OP3 P8-P10 R10 R14 R18-R35 R37 R38 R42-R52
拔码开关: C38 R93-R97 R102 R109 S1
情报面板硬接线: OP3 OP4 P26 R15-R17 R39-R41 R249-R251 U26
并行输入: C74 C75 C77 C78 C82 U2 U28-U31
拔位开关: R82-R86 R92 R98 R99 S4-S6 S8
CL-HC-A-V2.0: D15-D22 PA1-PA3 PAX R215-R218 RL30-RL33
面板灯输出: U8 U25 U27
接线端子: P2-P4
排风机自动门: C44-C50 D1 D14 DZ1 F7 J1 L1 P16 Pw1 RV1 U9
模拟输入: C1-C3 C13-C15 DW1-DW6 F1-F6 P5-P7 R1-R9 R11-R13
变频器反馈信号: OP7 P18 P20 P21 R68-R71 R75-R78 R252-R255 RL25 RL26 RL37
CPU模块: BT1 C60-C73 C76 C79-C81 C84 D12 D13 J2 JX4 JX5 JX7 JX8 R36 R103 R188-R190 RESET1 U33 Y1 Y2
RS485（隔离）: C54 C56 C58 D8 D10 F12 F14 JX1 P1 R170 R171#1 R174 R176 R178 R180 R182 R184 R185 U16-U18 U22 U24
RS485（隔离）: C55 C57 C59 D9 D11 F13 F15 JX2 P11 R172 R173 R175#1 R177#1 R179 R181 R183 R186 R187 U19-U21 U23 U32
电源控制: D95-D98 D109 D199 P12 Q13 Q15-Q22 R257-R272 R275 R276 R283-R285 RL35 RL36 RL40
联动输出: P17 RL23 RL24
CL-HC-V1.5-B: PB1 PB1' PB2-PB7 RL4 RL7 RL8 RL14-RL22
排风机自动门: LD1-LD64 Q3-Q6 R191-R214
CL-HC-B-V2.0: D37-D48 R147#2 R148#2 R149#2 R150#2 R151#2 R152#2 R153#2 R154#2 R155#2 R156#2 R157#2 R158#2
接口: F16 F17 P19 P23 P30 P32
CL-HC-C-V2.0: D49-D55 D61 D65 D67 D110 PC1-PC5 PC7 R159#2 R160#2 R161#2 R162#2 R163#2 R164#2 R165#2 R171#2 R175#2 R177#2 R292 RL1-RL3 RL5 RL6 RL9-RL13 RL34 SX1

## Nets
2-38: P17.3 RL24.3
2-39: P17.4 RL24.4
2-40: P17.1 RL23.3
2-41: P17.2 RL23.4
3-24: P13.8 RL27.3
3-25: P13.7 RL29.3
3-26: P13.6 RL29.4
3-27: P13.5 RL28.3
3-28: P13.4 RL28.4
3V3: C49.1 C50.1 C60.2 C61.2 C62.2 C63.2 C64.2 C65.2 C66.2 C67.2 C68.2 C69.2 C70.2 C71.2 C74.2 C75.2 C76.2 C77.2 C78.2 C82.2 C84.2 D12.2(K) D13.1(A) J2.1 JX8.1 JX8.2 JX8.3 Q3.3(E) Q4.3(E) Q5.3(E) Q6.3(E) Q16.3(E) Q20.3(E) R39.2 R40.2 R41.2 R42.2 R43.2 R44.2 R45.2 R46.2 R47.2 R48.2 R49.2 R50.2 R51.2 R52.2 R66.1 R75.2 R76.2 R77.2 R78.2 R81.2 R82.2 R83.1 R84.1 R85.1 R86.1 R87.2 R88.2 R89.2 R90.2 R91.2 R92.1 R93.2 R94.2 R95.2 R96.2 R97.2 R98.1 R99.1 R109.1 R148#1.2 R149#1.2 R150#1.2 R151#1.2 R152#1.2 R174.1 R175#1.1 R189.1 R207.1 R209.1 R211.1 R213.1 R259.1 R267.1 U2.16(VCC) U9.2(OUT) U17.1 U18.1 U20.1 U21.1 U28.16(VCC) U29.16(VCC) U30.16(VCC) U31.16(VCC) U33.17(Vdd_5) U33.32(Vref+) U33.33(VDDA) U33.39(Vdd_4) U33.52(Vdd_6) U33.62(Vdd_7) U33.72(Vdd_1) U33.84(Vdd_8) U33.95(Vdd_9) U33.108(Vdd_2) U33.121(Vdd_10) U33.131(Vdd_11) U33.144(Vdd_3)
3V<-手动冬季: S4.3 U33.22(PF10/ADC3_IN8/FSMC_INTR)
3V<-手动夏季: R82.1 S4.1 U29.13(C)
10V-面板-温度输入: F6.1 P26.16
10V-面板-湿度输入: F2.1 P26.15
24V: C19.2 C20.2 C37.2 C39.2 C44.1 C45.1 C85.1 C86.1 C87.1 C88.1 D1.3(+) D14.A D95.K D97.K D109.K P5.2 P6.2 P7.1 P20.3 P21.3 P22.22 P22.23 P26.1 P26.2 P27.15 Pw1.1(IN) R264.1 R272.1 R285.1 RL23.1 RL24.1 RL25.1 RL26.1 RL27.2 RL28.2 RL29.1 RL35.1 RL36.1 RL37.1 RL40.1 U1.8(V) U3.9(COM) U4.9(COM) U5.8(V) U6.8(V) U7.8(V) U8.9(COM) U14.9(COM) U15.9(COM) U25.9(COM) U26.9(COM) U27.9(COM)
24V-DI: D14.K R10.1 R14.1 R15.1 R16.1 R17.1 R18.1 R19.1 R20.1 R21.1 R22.1 R23.1 R24.1 R25.1 R26.1 R27.1 R28.1 R29.1 R30.1 R31.1 R32.1 R33.1 R34.1 R35.1 R37.1 R38.1 R53.1 R54.1 R55.1 R56.1 R57.1 R64.1 R65.1 R72.1 R73.1 R74.1 R79.1 R80.1 R249.1 R250.1 R251.1
24V-情报-负压: OP3.2 P26.6 R249.2
24V-情报-远值: OP4.8 P26.7 R250.2
24V-情报-远启: OP4.6 P26.9 R251.2
24V-面板-值机: P26.10 U26.14(OUT3)
24V-面板-故障: P26.14 U26.16(OUT1)
24V-面板-滤网: P26.12 U26.15(OUT2)
24V-面板-运行: P26.8 U26.13(OUT4)
24VIN+: F7.1 P16.2
24VIN-: D1.2(AC) P16.1
485-GND1: C51.1 C52.1 D6.A D7.A P15.1 Q2.3(E) R166.2 R169.1 U12.5(GND) U13.5(GND) U52.3(V_Gout)
485-VCC-1: C51.2 C52.2 R161#1.1 R162#1.1 R164#1.1 R165#1.2 R167.1 U12.7(VCC) U12.8(VCC) U13.8(VCC) U52.4(V_Out)
485_GND_1: C57.1 C59.1 D9.A D11.A P11.3 R181.1 R187.1 U21.3 U23.5(GND) U32.3(V_Gout)
485_GND_2: C56.1 C58.1 D8.A D10.A P1.3 R180.1 R185.1 U18.3 U22.5(GND) U24.3(V_Gout)
485_VCC_1: C57.2 C59.2 R177#1.1 R179.2 R183.2 U20.4 U23.8(VCC) U32.4(V_Out)
485_VCC_2: C56.2 C58.2 R176.1 R178.2 R182.2 U17.4 U22.8(VCC) U24.4(V_Out)
GND: BT1.2(-) C1.2 C2.2 C3.2 C4.2 C5.2 C6.2 C7.2 C8.2 C9.2 C10.2 C11.2 C13.2 C14.2 C15.2 C19.1 C20.1 C21.2 C22.2 C23.2 C24.2 C25.2 C26.2 C27.2 C28.2 C29.2 C30.2 C31.2 C32.2 C37.1 C38.2 C39.1 C40.2 C41.2 C42.2 C43.2 C44.2 C45.2 C46.2 C47.2 C48.2 C49.2 C50.2 C53.1 C54.1 C55.2 C60.1 C61.1 C62.1 C63.1 C64.1 C65.1 C66.1 C67.1 C68.1 C69.1 C70.1 C71.1 C72.2 C73.2 C74.1 C75.1 C76.1 C77.1 C78.1 C79.2 C80.2 C81.2 C82.1 C83.1 C84.1 C85.2 C86.2 C87.2 C88.2 D1.4(-) D2.A D3.A DW1.A DW2.A DW3.A DW4.A DW5.A DW6.A DZ1.A F17.1 J1.2 J1.3 J2.5 JX1.1 JX2.1 JX4.1 JX5.1 JX7.1 JX7.2 JX7.3 OP1.9 OP1.11 OP1.13 OP1.15 OP2.9 OP2.11 OP2.13 OP2.15 OP3.9 OP3.11 OP3.13 OP3.15 OP4.9 OP4.11 OP4.13 OP4.15 OP5.9 OP5.11 OP5.13 OP5.15 OP6.2 OP6.4 OP6.6 OP6.8 OP6.9 OP6.11 OP6.13 OP6.15 OP7.2 OP7.4 OP7.6 OP7.8 OP7.9 OP7.11 OP7.13 OP7.15 OP8.2 OP8.3 P5.3 P6.3 P7.2 P8.1 P8.3 P8.5 P8.7 P9.1 P9.3 P9.5 P9.7 P10.1 P10.3 P10.5 P13.2 P19.2 P20.4 P22.8 P24.1 P24.3 P24.5 P25.1 P25.3 P25.5 P26.3 P26.4 P27.17 P30.4 Pw1.3(GND) Pw1.5(~{ON}) PX14.2 PX15.2 PX23.2 PX24.2 Q1.3(E) Q17.3(E) Q21.3(E) Q22.3(E) R4.1 R5.1 R6.1 R11.1 R12.1 R13.1 R36.1 R60.1 R61.2 R102.2 R103.1 R111.1 R112.1 R113.1 R114.1 R131.1 R132.1 R133.1 R134.1 R153#1.2 R154#1.2 R155#1.2 R156#1.2 R157#1.2 R252.2 R253.2 R254.2 R255.2 R275.1 R276.1 R284.1 RESET1.2 S1.6(B5) S1.7(B4) S1.8(B3) S1.9(B2) S1.10(B1) S4.2 S5.2 S6.2 S8.1 U1.4(G) U2.8(GND) U2.10(SI) U2.15(CLK_INH) U3.8(GND) U4.8(GND) U5.4(G) U6.4(G) U7.4(G) U8.8(GND) U9.1(GND) U10.5(GND) U11.5(GND) U14.8(GND) U15.8(GND) U16.3 U19.3 U24.1(V_Gin) U25.8(GND) U26.8(GND) U27.8(GND) U28.8(GND) U28.15(CLK_INH) U29.8(GND) U29.15(CLK_INH) U30.8(GND) U30.15(CLK_INH) U31.8(GND) U31.15(CLK_INH) U32.1(V_Gin) U33.16(Vss_5) U33.30(VSSA) U33.31(Vref-) U33.38(Vss_4) U33.51(Vss_6) U33.61(Vss_7) U33.71(Vss_1) U33.83(Vss_8) U33.94(Vss_9) U33.107(Vss_2) U33.120(Vss_10) U33.130(Vss_11) U33.143(Vss_3) U52.1(V_Gin)
L: P32.2 RL27.4 RL35.4
PE: P2.1 P3.1 P4.1 P5.1 P6.1 P7.5 P13.1 P19.1
STM32-R/T4: D4.A Q1.1(C) R62.2 U10.2(RE) U10.3(DE) U33.110(PA15/JTDI/SPI3_NSS/I2S3_WS)
STM32-RX4: R158#1.1 R159#1.2 U10.4(DI) U11.6(OUT) U33.112(PC11/USART4_RX/SDIO_D3)
STM32-TX4: R63.2 R160#1.2 U10.1(RO) U33.111(PC10/USART4_TX/SDIO_D2)
VCC: C46.1 C47.1 C48.1 C54.2 C55.1 C83.2 J1.1 L1.2 P30.3 Pw1.4(REF) R67.1 U9.3(IN) U24.2(V_in) U32.2(V_in) U52.2(V_in)
VCC-SEL: C53.2 R59.1 R62.1 R63.1 R66.2 R67.2 R159#1.1 U10.8(VCC) U11.7(VCC) U11.8(VCC) U12.2(A)
冷/热水: C17.2 C23.1 P4.4 PX15.3 R118.2 R121.2
冷水阀执行: C12.2 C21.1 P3.4 PX14.3 R117.2 R119.2
加湿器控制: C35.2 C42.1 P13.3 PX24.3 R138.2 R141.2
变频控制电压选择: R83.2 S8.2 U29.14(D)
大地: P26.5
手动频率: C18.2 C24.1 PX15.1 R116.2 R122.2
热水阀执行: C16.2 C22.1 P2.4 PX14.1 R115.2 R120.2
硬接线-温度: C33.2 C40.1 P26.11 PX23.3 R137.2 R139.2
硬接线-湿度: C34.2 C41.1 P26.13 PX23.1 R135.2 R140.2
3V- S1: R93.1 S1.1(A1) U30.6(H)
3V- S2: R94.1 S1.2(A2) U30.4(F)
3V- S3: R95.1 S1.3(A3) U30.3(E)
3V- S4: R96.1 S1.4(A4) U30.14(D)
3V- S5: R97.1 S1.5(A5) U30.13(C)
3V- SETX1: R98.2 U29.12(B)
3V- SETX2: R99.2 U29.11(A)
3V- 三角形: R86.2 S6.3 U30.5(G)
3V- 变频: R92.2 S5.1 U29.6(H)
3V- 定频: R84.2 S5.3 U30.11(A)
3V- 星形: R85.2 S6.1 U30.12(B)
3V-LAMP-EX1: U27.1(IN1) U33.117(PD3/FSMC_CLK)
3V-LAMP-EX2: U27.2(IN2) U33.93(PG8)
3V-中效: OP2.10 R46.1 U31.6(H)
3V-中效报警灯: U8.3(IN3) U33.18(PF6/ADC3_IN4/FSMC_NIORD)
3V-亚高效: OP2.12 R47.1 U31.5(G)
3V-亚高效报警灯: U8.5(IN5) U33.14(PF4/FSMC_A4)
3V-值机: U27.4(IN4) U33.91(PG6/FSMC_INT2)
3V-停机保温: U15.1(IN1) U33.58(PE7/FSMC_D4)
3V-初效: OP1.14 R44.1 U31.12(B)
3V-初效报警灯: U8.2(IN2) U33.19(PF7/ADC3_IN5/FSMC_NREG)
3V-加湿器-加湿互锁: U3.7(IN7) U33.87(PG2/FSMC_A12)
3V-加湿器-加湿开关: U3.6(IN6) U33.86(PD15/FSMC_D1)
3V-加湿器-加湿电磁阀: U3.5(IN5) U33.85(PD14/FSMC_D0)
3V-加热1: U4.4(IN4) U33.75(PB14/SPI2_MISO/USART3_RTS/TIM1_CH2N)
3V-加热2: U14.2(IN2) U33.50(PF12/FSMC_A6)
3V-加热3: U4.6(IN6) U33.77(PD8/FSMC_D13)
3V-变频: U3.1(IN1) U33.79(PD10/FSMC_D15)
3V-变频开启: U27.3(IN3) U33.92(PG7/FSMC_INT3)
3V-备用: U27.5(IN5) U33.90(PG5/FSMC_A15)
3V-外急停开关: OP1.12 R43.1 R263.2 U31.13(C)
3V-外接急停报警: U25.6(IN6) U33.2(PE3/TRACED0/FSMC_A19)
3V-定量阀: U4.7(IN7) U33.78(PD9/FSMC_D14)
3V-定频: U3.2(IN2) U33.80(PD11/FSMC_A16)
3V-密闭阀: U4.5(IN5) U33.76(PB15/SPI2_MOSI/I2S2_SD/TIM1_CH3N)
3V-排风机1: OP5.10 R91.1 U28.3(E)
3V-排风机2: OP5.12 R90.1 U28.4(F)
3V-排风机3: OP5.14 R89.1 U28.5(G)
3V-排风机4: OP5.16 R88.1 U28.6(H)
3V-排风机5: OP4.14 R87.1 U28.13(C)
3V-排风机6: OP4.16 R81.1 U28.14(D)
3V-控制-排风机1: U14.1(IN1) U33.49(PF11/FSMC_NIOS16)
3V-控制-排风机2: U14.3(IN3) U33.53(PF13/FSMC_A7)
3V-控制-排风机3: U14.4(IN4) U33.54(PF14/FSMC_A8)
3V-控制-排风机4: U14.5(IN5) U33.55(PF15/FSMC_A9)
3V-控制-排风机5: U14.6(IN6) U33.56(PG0/FSMC_A10)
3V-控制-排风机6: U14.7(IN7) U33.57(PG1/FSMC_A11)
3V-故障联运输出: U27.6(IN6) U33.89(PG4/FSMC_A14)
3V-散热扇: U3.4(IN4) U33.82(PD13/FSMC_A18)
3V-星三角: U3.3(IN3) U33.81(PD12/FSMC_A17)
3V-机组值机灯: U8.7(IN7) U33.12(PF2/FSMC_A2)
3V-机组故障灯: U8.1(IN1) U33.20(PF8/ADC3_IN6/FSMC_NIOWR)
3V-机组运行灯: U25.1(IN1) U33.11(PF1/FSMC_A1)
3V-杀菌灯: U15.2(IN2) U33.59(PE8/FSMC_D5)
3V-消防: OP1.10 R42.1 R262.2 U31.14(D)
3V-消防报警: U25.5(IN5) U33.3(PE4/TRACED1/FSMC_A20)
3V-电柜扇: U15.4(IN4) U33.65(PE12/FSMC_D9)
3V-电热高温报警灯: U25.3(IN3) U33.5(PE6/TRACED3/FSMC_A22)
3V-电预热高温报警灯: U25.2(IN2) U33.10(PF0/FSMC_A0)
3V-电高温: OP2.16 R49.1 R270.2 U31.3(E)
3V-管温: OP3.12 R51.1 U29.4(F)
3V-缺风: OP1.16 R45.1 R271.2 U31.11(A)
3V-缺风报警灯: U8.4(IN4) U33.15(PF5/FSMC_A5)
3V-负压: U15.3(IN3) U33.63(PE10/FSMC_D7)
3V-远值机: OP4.10 R40.1 U28.11(A)
3V-远启动: OP4.12 R41.1 U28.12(B)
3V-远负压: OP3.16 R39.1 U33.34(PA0-WKUP/USART2_CTS/ADC123_IN0/TIM5_CH1/TIM2_CH1_ETR/TIM8_ETR)
3V-防冻: OP3.14 R52.1 U29.3(E)
3V-防冻停机报警: U25.7(IN7) U33.1(PE2/TRACECK/FSMC_A23)
3V-防冻报警灯: U25.4(IN4) U33.4(PE5/TRACED2/FSMC_A21)
3V-面板-值机: U26.3(IN3) U33.27(PC1/ADC123_IN11)
3V-面板-故障: U26.1(IN1) U33.29(PC3/ADC123_IN13)
3V-面板-滤网: U26.2(IN2) U33.28(PC2/ADC123_IN12)
3V-面板-运行: U26.4(IN4) U33.26(PC0/ADC123_IN10)
3V-预热1: U4.1(IN1) U33.100(PA8/USART1_CK/TIM1_CH1/MCO)
3V-预热2: U4.2(IN2) U33.73(PB12/SIP2_NSS/I2S2_WS/I2C2_SMBAI/USART3_CK/TIM1_BKIN)
3V-预热3: U4.3(IN3) U33.74(PB13/SIP2_SCK/I2S2_CK/USART3_CTS/TIM1_CH1N)
3V-预高温: OP3.10 R50.1 R269.2 U29.5(G)
3V-高效: OP2.14 R48.1 U31.4(F)
3V-高效报警灯: U8.6(IN6) U33.13(PF3/FSMC_A3)
3V-高温联动输出: U27.7(IN7) U33.88(PG3/FSMC_A13)
3V<-变频故障: OP7.12 R76.1 U2.12(B)
3V<-变频运行: OP7.10 R75.1 U2.11(A)
3V<-工频故障: OP7.14 R77.1 U2.13(C)
3V<-工频运行: OP7.16 R78.1 U2.14(D)
3V<-急停按钮: OP8.4 R148#1.1 R261.2 U33.21(PF9/ADC3_IN7/FSMC_CD)
3V<-本地值机: OP6.14 R150#1.1 U2.5(G)
3V<-本地运行: OP6.16 R149#1.1 U2.6(H)
3V<-远值使能: OP6.10 R152#1.1 U2.3(E)
3V<-远起使能: OP6.12 R151#1.1 U2.4(F)
24V-中效报警灯: P22.2 U8.14(OUT3)
24V-亚高效报警灯: P22.4 U8.12(OUT5)
24V-值机: RL25.2 U27.13(OUT4)
24V-停机保温: P27.18 U15.16(OUT1)
24V-初效报警灯: P22.1 U8.15(OUT2)
24V-加湿器-加湿互锁: RL28.1 U3.10(OUT7)
24V-加湿器-加湿开关: RL29.2 U3.11(OUT6)
24V-加湿器-加湿电磁阀: RL27.1 U3.12(OUT5)
24V-加热1: P27.4 U4.13(OUT4)
24V-加热2: P27.19 U14.15(OUT2)
24V-加热3: P27.1 U4.11(OUT6)
24V-变频: P27.5 U3.16(OUT1)
24V-变频开启: RL26.2 U27.14(OUT3)
24V-备用: RL37.2 U27.12(OUT5)
24V-外接急停报警: P22.16 U25.11(OUT6)
24V-定量阀: P27.3 U4.10(OUT7)
24V-定频: P27.7 U3.15(OUT2)
24V-密闭阀: P27.2 U4.12(OUT5)
24V-排风机1: P27.13 U14.16(OUT1)
24V-排风机2: P27.21 U14.14(OUT3)
24V-排风机3: P27.23 U14.13(OUT4)
24V-排风机4: P27.24 U14.12(OUT5)
24V-排风机5: P27.22 U14.11(OUT6)
24V-排风机6: P27.20 U14.10(OUT7)
24V-故障联运输出: RL24.2 U27.11(OUT6)
24V-散热扇: P27.11 U3.13(OUT4)
24V-星三角: P27.9 U3.14(OUT3)
24V-机组值机灯: P22.7 U8.10(OUT7)
24V-机组故障灯: P22.5 U8.16(OUT1)
24V-机组运行灯: P22.9 U25.16(OUT1)
24V-杀菌灯: P27.16 U15.15(OUT2)
24V-消防报警: P22.14 U25.12(OUT5)
24V-电柜扇: P27.12 U15.13(OUT4)
24V-电热高温报警灯: P22.11 U25.14(OUT3)
24V-电预热高温报警灯: P22.10 U25.15(OUT2)
24V-缺风报警灯: P22.3 U8.13(OUT4)
24V-负压: P27.14 U15.14(OUT3)
24V-防冻停机报警: P22.18 U25.10(OUT7)
24V-防冻报警灯: P22.12 U25.13(OUT4)
24V-预热1: P27.10 U4.16(OUT1)
24V-预热2: P27.8 U4.15(OUT2)
24V-预热3: P27.6 U4.14(OUT3)
24V-高效报警灯: P22.6 U8.11(OUT6)
24V-高温联动输出: RL23.2 U27.10(OUT7)
165S_DO1: U2.9(QH) U28.10(SI)
165S_DO2: U28.9(QH) U29.10(SI)
165S_DO3: U29.9(QH) U30.10(SI)
165S_DO4: U30.9(QH) U31.10(SI)
220V_N: P13.9 P32.1
485-A-1: F15.1 P11.1 P30.1
485-A-2: F14.1 P1.1
485-B-1: F13.1 P11.2 P30.2
485-B-2: F12.1 P1.2
<-变频故障: P20.2 R69.1 R253.1
<-变频运行: P20.1 R68.1 R252.1
<-工频故障: P21.2 R70.1 R254.1
<-工频运行: P21.1 R71.1 R255.1
<-急停按钮: P22.21 R143.1
<-本地值机: P22.15 R145.1
<-本地运行: P22.13 R144.1
<-远值使能: P22.19 R147#1.1
<-远起使能: P22.17 R146.1
AC24GATE1: F17.2 P2.3 P3.3 P4.3 P23.1
AC24GATE2: F16.1 P2.2 P3.2 P4.2
AD1: F4.1 P6.4
AD2: F3.1 P5.4
AD5: F1.1 P7.3
AD6: F5.1 P7.4
BOOT0: R36.2 U33.138(BOOT0)
BOOT1: R103.2 U33.48(PB2/BOOT1)
CAN-RX-2: U33.114(PD0/FSMC_D2)
CAN-TX-2: U33.115(PD1/FSMC_D3)
CLK_165: U2.2(CLK) U28.2(CLK) U29.2(CLK) U30.2(CLK) U31.2(CLK) U33.104(PA12/USART1_RTS/CANTX/TIM1_ETR/USBDP)
COM1: LD1.A LD2.A LD3.A LD4.A LD5.A LD6.A LD7.A LD8.A LD9.A LD10.A LD11.A LD12.A LD13.A LD14.A LD15.A LD16.A Q3.1(C)
COM2: LD17.A LD18.A LD19.A LD20.A LD21.A LD22.A LD23.A LD24.A LD25.A LD26.A LD27.A LD28.A LD29.A LD30.A LD31.A LD32.A Q4.1(C)
COM3: LD33.A LD34.A LD35.A LD36.A LD37.A LD38.A LD39.A LD40.A LD41.A LD42.A LD43.A LD44.A LD45.A LD46.A LD47.A LD48.A Q5.1(C)
COM4: LD49.A LD50.A LD51.A LD52.A LD53.A LD54.A LD55.A LD56.A LD57.A LD58.A LD59.A LD60.A LD61.A LD62.A LD63.A LD64.A Q6.1(C)
C变频: P18.5 RL25.3 RL26.4 RL37.4
EX_A1: F11.1 P15.3
EX_B1: F10.1 P15.2
JTCK: J2.3 U33.109(PA14/JTMS-SWCLK)
JTMS: J2.4 U33.105(PA13/JTMS-SWDIO)
LAMP-EX1: P22.20 U27.16(OUT1)
LAMP-EX2: P22.24 U27.15(OUT2)
LED-COM01: R207.2 R208.2 U33.140(PB9/TIM4_CH4/SDIO_D5)
LED-COM02: R209.2 R210.2 U33.139(PB8/TIM4_CH3/SDIO_D4)
LED-COM03: R211.2 R212.2 U33.137(PB7/I2C1_SDA/FSMC_NADV/TIM4_CH2)
LED-COM04: R213.2 R214.2 U33.136(PB6/I2C1_SCL/TIM4_CH1)
LED-OUT-PIN01: LD1.K LD17.K LD33.K LD49.K R191.2
LED-OUT-PIN02: LD2.K LD18.K LD34.K LD50.K R192.2
LED-OUT-PIN03: LD3.K LD19.K LD35.K LD51.K R193.2
LED-OUT-PIN04: LD4.K LD20.K LD36.K LD52.K R194.2
LED-OUT-PIN05: LD5.K LD21.K LD37.K LD53.K R195.2
LED-OUT-PIN06: LD6.K LD22.K LD38.K LD54.K R196.2
LED-OUT-PIN07: LD7.K LD23.K LD39.K LD55.K R197.2
LED-OUT-PIN08: LD8.K LD24.K LD40.K LD56.K R198.2
LED-OUT-PIN09: LD9.K LD25.K LD41.K LD57.K R199.2
LED-OUT-PIN10: LD10.K LD26.K LD42.K LD58.K R200.2
LED-OUT-PIN11: LD11.K LD27.K LD43.K LD59.K R201.2
LED-OUT-PIN12: LD12.K LD28.K LD44.K LD60.K R202.2
LED-OUT-PIN13: LD13.K LD29.K LD45.K LD61.K R203.2
LED-OUT-PIN14: LD14.K LD30.K LD46.K LD62.K R204.2
LED-OUT-PIN15: LD15.K LD31.K LD47.K LD63.K R205.2
LED-OUT-PIN16: LD16.K LD32.K LD48.K LD64.K R206.2
LED-PIN01: R191.1 U33.118(PD4/FSMC_NOE)
LED-PIN02: R192.1 U33.119(PD5/FSMC_NWE)
LED-PIN03: R193.1 U33.122(PD6/FSMC_NWAIT)
LED-PIN04: R194.1 U33.123(PD7/FSMC_NE1/FSMC_NCE2)
LED-PIN05: R195.1 U33.124(PG9/FSMC_NE2/FSMC_NCE3)
LED-PIN06: R196.1 U33.125(PG10/FSMC_NCE4_1/FSMC_NE3)
LED-PIN07: R197.1 U33.126(PG11/FSMC_NCE4_2)
LED-PIN08: R198.1 U33.127(PG12/FSMC_NE4)
LED-PIN09: R199.1 U33.128(PG13/FSMC_A24)
LED-PIN10: R200.1 U33.129(PG14/FSMC_A25)
LED-PIN11: R201.1 U33.132(PG15)
LED-PIN12: R202.1 U33.133(PB3/JTDO/TRACESWO/SPI3_SCK/I2S3_CK)
LED-PIN13: R203.1 U33.134(PB4/JNTRST/SPI3_MISO)
LED-PIN14: R204.1 U33.135(PB5/I2C1_SMBAI/SPI3_MOSI/I2S3_SD)
LED-PIN15: R205.1 U33.141(PE0/TIM4_ETR/FSMC_NBL0)
LED-PIN16: R206.1 U33.142(PE1/FSMC_NBL1)
L加热: P12.2 RL36.3
L变频: P12.3 RL35.3 RL36.4 RL40.4
L预热: P12.1 RL40.3
MCUVBAT: BT1.1(+) R190.2 U33.6(VBAT)
PLD_165: U2.1(S/L) U28.1(S/L) U29.1(S/L) U30.1(S/L) U31.1(S/L) U33.103(PA11/USART1_CTS/CANRX/TIM1_CH4/USBDM)
POL_A2: F9.1 P14.3
POL_B2: F8.1 P14.6
PWM1-T8C3: R125.1 U33.98(PC8/TIM8_CH3/SDIO_D0)
PWM2-T8C4: R126.1 U33.99(PC9/TIM8_CH4/SDIO_D1)
PWM3-T8C1: R101.1 U33.96(PC6/I2S2_MCK/TIM8_CH1/SDIO_D6)
PWM4-T8C2: R100.1 U33.97(PC7/I2S3_MCK/TIM8_CH2/SDIO_D7)
PWM5-T1C1: R124.1 U33.60(PE9/FSMC_D6)
PWM6-T1C2: R123.1 U33.64(PE11/FSMC_D8)
PWM7-T1C3: R105.1 U33.66(PE13/FSMC_D10)
PWM8-T1C4: R104.1 U33.67(PE14/FSMC_D11)
RESET: C80.1 D12.1(A) J2.2 R189.2 RESET1.1 U33.25(NRST)
SDO_165: U31.9(QH) U33.46(PB0/ADC12_IN8/TIM3_CH3/TIM8_CH2N)
STM32-R/T2: R170.2 U33.35(PA1/USART2_RTS/ADC123_IN1/TIM5_CH2/TIM2_CH2)
STM32-R/T3: R172.2 U33.68(PE15/FSMC_D12)
STM32-RX1: JX4.3 U33.102(PA10/USART1_RX/TIM1_CH3)
STM32-RX2: JX1.2 R174.2 U16.4 U33.37(PA3/USART2_RX/TIM5_CH4/ADC123_IN3/TIM2_CH4)
STM32-RX3: JX2.3 R175#1.2 U19.4 U33.70(PB11/I2C2_SDA/USART3_RX)
STM32-RX5: JX5.3 U33.116(PD2/TIM3_ETR/USART5_RX/SDIO_CMD)
STM32-TX1: JX4.2 U33.101(PA9/USART1_TX/TIM1_TX/TIM1_CH2)
STM32-TX2: JX1.3 R171#1.2 U33.36(PA2/USART2_TX/TIM5_CH3/ADC123_IN2/TIM2_CH3)
STM32-TX3: JX2.2 R173.2 U33.69(PB10/I2C2_SCL/USART3_TX)
STM32-TX5: JX5.2 U33.113(PC12/USART5_TX/SDIO_CK)
中效: OP2.8 P9.6 R25.2
亚高效: OP2.6 P9.4 R27.2
初效: OP1.4 P9.8 R21.2
变频值机: P18.3 RL25.5
变频全速: P18.2 RL25.4
变频备用: P18.1 RL37.3
变频开启: P18.4 RL26.3
回风压差: C14.1 DW5.K R8.1 R12.2 U33.44(PC4/ADC12_IN14)
回风温度: C3.1 DW3.K R3.1 R6.2 U33.45(PC5/ADC12_IN15)
回风湿度: C13.1 DW4.K R7.1 R11.2 U33.42(PA6/SPI1_MISO/TIM8_BKIN/ADC12_IN6/TIM3_CH1)
外急停开关: OP1.6 P10.6 R19.2
手动调速: C38.1 R102.1 R109.2 U33.47(PB1/ADC12_IN9/TIM3_CH4/TIM8_CH3N)
消防: OP1.8 P10.4 R14.2
电高温: OP2.2 P8.8 R31.2
管温: OP3.6 P8.4 R35.2
缺风: OP1.2 P10.2 R23.2
自动门开关1: OP4.2 P25.6 R54.2
自动门开关2: OP4.4 P25.4 R56.2
自动门开关3: OP5.2 P25.2 R64.2
自动门开关4: OP5.4 P24.6 R72.2
自动门开关5: OP5.6 P24.4 R74.2
自动门开关6: OP5.8 P24.2 R80.2
设定温度: C15.1 DW6.K R9.1 R13.2 U33.41(PA5/SPI1_SCK/DAC_OUT2/ADC12_IN5)
设定湿度: C2.1 DW2.K R2.1 R5.2 U33.40(PA4/SPI1_NSS/DAC_OUT1/USART2_CK/ADC12_IN4)
防冻: OP3.4 P8.2 R38.2
预热温感: C1.1 DW1.K R1.1 R4.2 U33.43(PA7/SPI1_MOSI/TIM8_CH1N/ADC12_IN7/TIM3_CH2)
预高温: OP3.8 P8.6 R33.2
频率输出: C36.2 C43.1 P19.3 P19.4 PX24.1 R136.2 R142.2
高效: OP2.4 P9.2 R29.2
NetC4_1: C4.1 R100.2 R106.1
NetC5_1: C5.1 R101.2 R107.1
NetC6_1: C6.1 R104.2 R108.1
NetC7_1: C7.1 R105.2 R110.1
NetC8_1: C8.1 R106.2 U1.3(+)
NetC9_1: C9.1 R107.2 U1.5(+)
NetC10_1: C10.1 R108.2 U5.3(+)
NetC11_1: C11.1 R110.2 U5.5(+)
NetC12_1: C12.1 R111.2 R117.1 U1.2(--)
NetC16_1: C16.1 R112.2 R115.1 U1.6(--)
NetC17_1: C17.1 R113.2 R118.1 U5.2(--)
NetC18_1: C18.1 R114.2 R116.1 U5.6(--)
NetC25_1: C25.1 R123.2 R127.1
NetC26_1: C26.1 R124.2 R128.1
NetC27_1: C27.1 R125.2 R129.1
NetC28_1: C28.1 R126.2 R130.1
NetC29_1: C29.1 R127.2 U6.3(+)
NetC30_1: C30.1 R128.2 U6.5(+)
NetC31_1: C31.1 R129.2 U7.3(+)
NetC32_1: C32.1 R130.2 U7.5(+)
NetC33_1: C33.1 R131.2 R137.1 U6.2(--)
NetC34_1: C34.1 R132.2 R135.1 U6.6(--)
NetC35_1: C35.1 R133.2 R138.1 U7.2(--)
NetC36_1: C36.1 R134.2 R136.1 U7.6(--)
NetC72_1: C72.1 U33.9(PC15-OSC32_OUT) Y1.1
NetC73_1: C73.1 U33.8(PC14-OSC32_IN) Y1.2
NetC79_1: C79.1 R188.2 U33.23(OSC_IN) Y2.1
NetC81_1: C81.1 R188.1 U33.24(OSC_OUT) Y2.2
NetD1_1: D1.1(AC) F7.2
NetD2_K: D2.K F9.2 R58.2 R59.2 U10.6(A)
NetD3_K: D3.K F8.2 R58.1 R60.2 U10.7(B)
NetD4_K: D4.K R61.1
NetD5_A: D5.A Q2.1(C) R164#1.2 U13.2(RE) U13.3(DE)
NetD5_K: D5.K R166.1
NetD6_K: D6.K F10.2 R168.1 R169.2 U13.7(B)
NetD7_K: D7.K F11.2 R167.2 R168.2 U13.6(A)
NetD8_K: D8.K F12.2 R184.1 R185.2 U22.7(B)
NetD9_K: D9.K F13.2 R186.1 R187.2 U23.7(B)
NetD10_K: D10.K F14.2 R182.1 R184.2 U22.6(A)
NetD11_K: D11.K F15.2 R183.1 R186.2 U23.6(A)
NetD13_2: D13.2(K) R190.1
NetD95_A: D95.A D96.K Q17.1(C) RL35.2
NetD96_A: D96.A R264.2
NetD97_A: D97.A D98.K Q21.1(C) RL36.2
NetD98_A: D98.A R272.2
NetD109_A: D109.A D199.K Q22.1(C) RL40.2
NetD199_A: D199.A R285.2
NetDZ1_K: DZ1.K L1.1 Pw1.2(OUT)
NetF1_2: F1.2 R1.2
NetF2_2: F2.2 R2.2
NetF3_2: F3.2 R3.2
NetF4_2: F4.2 R7.2
NetF5_2: F5.2 R8.2
NetF6_2: F6.2 R9.2
NetF16_2: F16.2 P23.2
NetOP1_1: OP1.1 R22.2
NetOP1_3: OP1.3 R20.2
NetOP1_5: OP1.5 R18.2
NetOP1_7: OP1.7 R10.2
NetOP2_1: OP2.1 R30.2
NetOP2_3: OP2.3 R28.2
NetOP2_5: OP2.5 R26.2
NetOP2_7: OP2.7 R24.2
NetOP3_1: OP3.1 R15.2
NetOP3_3: OP3.3 R37.2
NetOP3_5: OP3.5 R34.2
NetOP3_7: OP3.7 R32.2
NetOP4_1: OP4.1 R53.2
NetOP4_3: OP4.3 R55.2
NetOP4_5: OP4.5 R17.2
NetOP4_7: OP4.7 R16.2
NetOP5_1: OP5.1 R57.2
NetOP5_3: OP5.3 R65.2
NetOP5_5: OP5.5 R73.2
NetOP5_7: OP5.7 R79.2
NetOP6_1: OP6.1 R144.2 R154#1.1
NetOP6_3: OP6.3 R145.2 R155#1.1
NetOP6_5: OP6.5 R146.2 R156#1.1
NetOP6_7: OP6.7 R147#1.2 R157#1.1
NetOP7_1: OP7.1 R71.2
NetOP7_3: OP7.3 R70.2
NetOP7_5: OP7.5 R69.2
NetOP7_7: OP7.7 R68.2
NetOP8_1: OP8.1 R143.2 R153#1.1
NetQ1_2: Q1.2(B) R158#1.2
NetQ2_2: Q2.2(B) R163#1.1
NetQ3_2: Q3.2(B) R208.1
NetQ4_2: Q4.2(B) R210.1
NetQ5_2: Q5.2(B) R212.1
NetQ6_2: Q6.2(B) R214.1
NetQ13_1: Q13.1(C) R260.2
NetQ13_2: Q13.2(B) R257.2 R261.1
NetQ13_3: Q13.3(E) Q15.1(C) R257.1
NetQ15_2: Q15.2(B) R258.2 R262.1
NetQ15_3: Q15.3(E) Q16.1(C) R258.1
NetQ16_2: Q16.2(B) R259.2 R263.1
NetQ17_2: Q17.2(B) R260.1 R275.2
NetQ18_1: Q18.1(C) R283.1
NetQ18_2: Q18.2(B) R265.2 R269.1
NetQ18_3: Q18.3(E) Q19.3(E) Q20.1(C) R265.1 R266.1
NetQ19_1: Q19.1(C) R268.1
NetQ19_2: Q19.2(B) R266.2 R270.1
NetQ20_2: Q20.2(B) R267.2 R271.1
NetQ21_2: Q21.2(B) R268.2 R276.2
NetQ22_2: Q22.2(B) R283.2 R284.2
NetR119_1: R119.1 U1.1(OUT)
NetR120_1: R120.1 U1.7(OUT)
NetR121_1: R121.1 U5.1(OUT)
NetR122_1: R122.1 U5.7(OUT)
NetR139_1: R139.1 U6.1(OUT)
NetR140_1: R140.1 U6.7(OUT)
NetR141_1: R141.1 U7.1(OUT)
NetR142_1: R142.1 U7.7(OUT)
NetR160#1_1: R160#1.1 U12.3(K)
NetR161#1_2: R161#1.2 U11.2(A)
NetR162#1_2: R162#1.2 R163#1.2 U12.6(OUT) U13.4(DI)
NetR165#1_1: R165#1.1 U11.3(K) U13.1(RO)
NetR170_1: R170.1 U17.2
NetR171#1_1: R171#1.1 U18.2
NetR172_1: R172.1 U20.2
NetR173_1: R173.1 U21.2
NetR176_2: R176.2 U18.4 U22.4(DI)
NetR177#1_2: R177#1.2 U21.4 U23.4(DI)
NetR178_1: R178.1 U16.1
NetR179_1: R179.1 U19.1
NetR180_2: R180.2 U17.3 U22.2(RE) U22.3(DE)
NetR181_2: R181.2 U20.3 U23.2(RE) U23.3(DE)
NetU16_2: U16.2 U22.1(RO)
NetU19_2: U19.2 U23.1(RO)

Not connected (* = marked no-connect by the designer): P14 1 2 4 5 7 8; R102 3; S8 3; U2 7(~{QH})*; U11 1(NC) 4(NC); U12 1(NC) 4(NC); U15 5(IN5) 6(IN6) 7(IN7) 10(OUT7) 11(OUT6) 12(OUT5); U26 5(IN5) 6(IN6) 7(IN7) 10(OUT7) 11(OUT6) 12(OUT5); U28 7(~{QH})*; U29 7(~{QH})*; U30 7(~{QH}); U31 7(~{QH})*; U33 7(PC13-TAMPER-RTC) 106(NC)

## Notes on the sheet
- 缺风报警灯
- 初效报警灯
- 中效报警灯
- 亚高效报警灯
- 电热高温报警灯
- 机组运行灯
- 机组值机灯
- 机组故障灯
- 电源灯
- 高效报警灯
- 电预热高温报警灯
- 防冻报警灯
- 消防报警
- 防冻停机报警
- 外接急停报警
- Labels drawn without touching a wire or pin: 3V-LAMP-EX1, 3V-LAMP-EX2, AD5, AD6, DE/RE4, DI1, DI2, DI37, STM32-R/T2, USB-D+, USB-D-

## Library data of the parts
C1-C3 C13-C15 C38 C48 C50-C53 C72 C73 C76 C79-C81 C83 = CAP: Capacitor
C4-C11 C21-C32 C40-C43 = CAP: Capacitor; 采购信息: 1uF 25V X7R,5%,50V,贴片电容 0805
C12 C16-C20 C33-C37 C39 = CAP: Capacitor; 采购信息: X7R,5%,50V,贴片电容
C44 C47 C60-C71 C74 C75 C77 C78 C82 C84 = CAP: Capacitor; 采购信息: 0.1uF X7R,5%,50V,贴片电容
C45 C85-C88 = ELECTRO1: Electrolytic Capacitor; 采购信息: 1000uf/25V 插件电解电容
C46 = Cap Pol1: Polarized Capacitor (Radial); 采购信息: 1000uf/25V 插件电解电容; Published: 8-Jun-2000; LatestRevisionDate: 17-Jul-2002; LatestRevisionNote: Re-released for DXP Platform.; PackageReference: RB7.6-15; Publisher: Altium Limited
C49 = ELECTRO1: Electrolytic Capacitor
C54-C59 = Cap: Capacitor; Published: 8-Jun-2000; LatestRevisionDate: 17-Jul-2002; LatestRevisionNote: Re-released for DXP Platform.; PackageReference: RAD-0.3; Publisher: Altium Limited
D1 = Bridge
D2 D3 D6-D14 D19-D22 D95 D97 D109 DW1-DW6 = DIODE
D4 D5 D15-D18 D37-D55 D61 D65 D67 D96 D98 D110 D199 LD1-LD64 = LED: Zener Diode
DZ1 = ZENER3: Zener Diode; 采购信息: SS36/60V  SMB 3A/60V
F1-F6 F8-F17 = Fuse 1: Fuse; Published: 8-Jun-2000; LatestRevisionDate: 17-Jul-2002; LatestRevisionNote: Re-released for DXP Platform.; PackageReference: PIN-W2/E2.8; Publisher: Altium Limited
F7 = Fuse 1: Fuse; 采购信息: 贴片保险丝 140mA X14 2512封装; Published: 8-Jun-2000; LatestRevisionDate: 17-Jul-2002; LatestRevisionNote: Re-released for DXP Platform.; PackageReference: PIN-W2/E2.8; Publisher: Altium Limited
J1 JX1 JX2 JX4 JX5 JX7 JX8 P1 P11 P12 P15 P21 PB1' PX14 PX15 PX23 PX24 = Header 3: Header, 3-Pin; LatestRevisionDate: 17-Jul-2002; LatestRevisionNote: Re-released for DXP Platform.; Publisher: Altium Limited
L1 = INDUCTOR: 采购信息: 10uH 贴片 12*12mm
P2-P6 P17 P19 P20 P30 PC1 PC2 = Header 4: Header, 4-Pin; LatestRevisionDate: 17-Jul-2002; LatestRevisionNote: Re-released for DXP Platform.; Publisher: Altium Limited
P7 P18 PA3 PC4 = Header 5: Header, 5-Pin; LatestRevisionDate: 17-Jul-2002; LatestRevisionNote: Re-released for DXP Platform.; Publisher: Altium Limited
P8 P9 PB4 = Header 8: Header, 8-Pin; LatestRevisionDate: 17-Jul-2002; LatestRevisionNote: Re-released for DXP Platform.; Publisher: Altium Limited
P10 P24 P25 PA1 PA2 PB2 PB3 PB5 SX1 = Header 6: Header, 6-Pin; LatestRevisionDate: 17-Jul-2002; LatestRevisionNote: Re-released for DXP Platform.; Publisher: Altium Limited
P13 = Header 9: Header, 9-Pin; LatestRevisionDate: 17-Jul-2002; LatestRevisionNote: Re-released for DXP Platform.; Publisher: Altium Limited
P14 = Header 4X2: Header, 4-Pin, Dual row; LatestRevisionDate: 17-Jul-2002; LatestRevisionNote: Re-released for DXP Platform.; Publisher: Altium Limited
P16 = Header 2: Header, 2-Pin; 采购信息: 环保，绿色，两边密闭，180度，两位; LatestRevisionDate: 17-Jul-2002; LatestRevisionNote: Re-released for DXP Platform.; Publisher: Altium Limited
P22 P27 PB7 PC7 = Header 12X2: Header, 12-Pin, Dual row; LatestRevisionDate: 17-Jul-2002; LatestRevisionNote: Re-released for DXP Platform.; Publisher: Altium Limited
P23 P32 PB1 PB6 PC3 PC5 = Header 2: Header, 2-Pin; LatestRevisionDate: 17-Jul-2002; LatestRevisionNote: Re-released for DXP Platform.; Publisher: Altium Limited
P26 PAX = Header 8X2: Header, 8-Pin, Dual row; LatestRevisionDate: 17-Jul-2002; LatestRevisionNote: Re-released for DXP Platform.; Publisher: Altium Limited
Pw1 = LM2576: 采购信息: LM2576 5V 国产 贴片
Q1 Q2 Q17 Q21 Q22 = NPN: NPN Bipolar Transistor; Published: 8-Jun-2000; LatestRevisionDate: 17-Jul-2002; LatestRevisionNote: Re-released for DXP Platform.; PackageReference: TO-226; Publisher: Altium Limited; Code_JEDEC: TO-226-AA
Q3-Q6 Q13 Q15 Q16 Q18-Q20 = PNP: PNP Bipolar Transistor; Published: 8-Jun-2000; LatestRevisionDate: 17-Jul-2002; LatestRevisionNote: Re-released for DXP Platform.; PackageReference: SOT-23B; Publisher: Altium Limited; Code_JEDEC: SOT-23
R1-R9 R11-R13 R109 = res
R10 R14 R18-R35 R37 R38 R42-R57 R64 R65 R72-R74 R79-R81 R87-R91 = RES2: 采购信息: 1K.1%,0.25W
R15-R17 R36 R39-R41 R58-R63 R66-R71 R75-R78 R82-R86 R92-R99 R103 R143-R146 R147#1 R147#2 R148#1 R148#2 R149#1 R149#2 R150#1 R150#2 R151#1 R151#2 R152#1 R152#2 R153#1 R153#2 R154#1 R154#2 R155#1 R155#2 R156#1 R156#2 R157#1 R157#2 R158#1 R158#2 R159#1 R159#2 R160#1 R160#2 R161#1 R161#2 R162#1 R162#2 R163#1 R163#2 R164#1 R164#2 R165#1 R165#2 R166-R170 R171#1 R171#2 R172-R174 R175#1 R175#2 R176 R177#1 R177#2 R178-R218 R249-R255 R257-R272 R275 R276 R283-R285 R292 = RES2
R100 R101 R104-R108 R110 R123-R130 = RES2: 采购信息: 100K,1%,0.25W
R102 = ResN
R111-R118 R131-R138 = RES2: 采购信息: 10K.1%,0.25W
R119-R122 R139-R142 = RES2: 采购信息: 100,5%,0.25W
RESET1 = SW-PB
RL1-RL6 RL10-RL24 RL26-RL33 RL35-RL37 RL40 = RELAY
RL7-RL9 RL25 RL34 = HF3FF
RV1 = Res Varistor: Varistor (Voltage-Sensitive Resistor); Published: 24-Mar-1999; LatestRevisionDate: 29-May-2009; LatestRevisionNote: IPC-7351 Footprint Added.; PackageVersion: Mar-2003; PackageReference: 6-0805; Publisher: Altium Limited; PackageDescription: Chip Resistor 0805 Case Size; Code_IPC: RESC2012
S1 = SW DIP-5: DIP Switch, 5 Position, SPST; Published: 24-Mar-1999; LatestRevisionDate: 17-Jul-2002; LatestRevisionNote: Re-released for DXP Platform.; PackageReference: N10A; Publisher: Altium Limited
S4-S6 S8 = SW-SPDT: SPDT Subminiature Toggle Switch, Right Angle Mounting, Vertical Actuation; Published: 24-Mar-1999; LatestRevisionDate: 17-Dec-2003; LatestRevisionNote: Schematic revised, PCB Footprint replaced.; DatasheetDocument: 05-Dec-2000; PackageReference: TL36WW15050; Publisher: Altium Limited; ComponentLink1Description: Manufacturer Link; ComponentLink1URL: http://www.apem.com
U1 U5-U7 = LM358: 采购信息: 贴片 LM358
U2 U28-U31 = DM74ALS165N: 8-Bit Parallel-In/Serial Out Shift Register; Note: Generic simulation model provided.; Published: 17-Jul-2002; LatestRevisionDate: 04-Mar-2005; LatestRevisionNote: Stylized 3D Model Added.; DatasheetVersion: Mar-1998; PackageVersion: 2000; PackageReference: N16A; Publisher: Altium Limited; PackageDescription: DIP; 16 Leads; Row Spacing 7.62 mm; Pitch 2.54 mm; ComponentLink1Description: Manufacturer Link; ComponentLink1URL: http://www.fairchildsemi.com/; ComponentLink2Description: Datasheet; ComponentLink2URL: http://www.fairchildsemi.com/ds/DM%2FDM74ALS165.pdf
U3 U4 U8 U14 U15 U25-U27 = ULN2003A: High-Voltage, High-Current Darlington Array; Published: *; LatestRevisionDate: *; LatestRevisionNote: *; DatasheetVersion: *; PackageVersion: *; PackageReference: *; Publisher: *; PackageDescription: *; Code_JEDEC: *; ComponentLink1Description: *; ComponentLink1URL: *
U24 U32 U52 = VScoure
Y1 Y2 = CRYSTAL